# EasyEDA Pro project ProProject_基于STM32的Buck-Boost型数字电源_2024-06-04.epro, schematic 电源板

## Sheets
1 主电路: Create Date: 2024-02-29; Page Name: 主电路; Project Name: 基于STM32的Buck-Boost型数字电源; Schematic Name: 电源板; Update Date: 2024-06-01; Company: blog.zeruns.tech; Page Size: A4; Version: V2.0
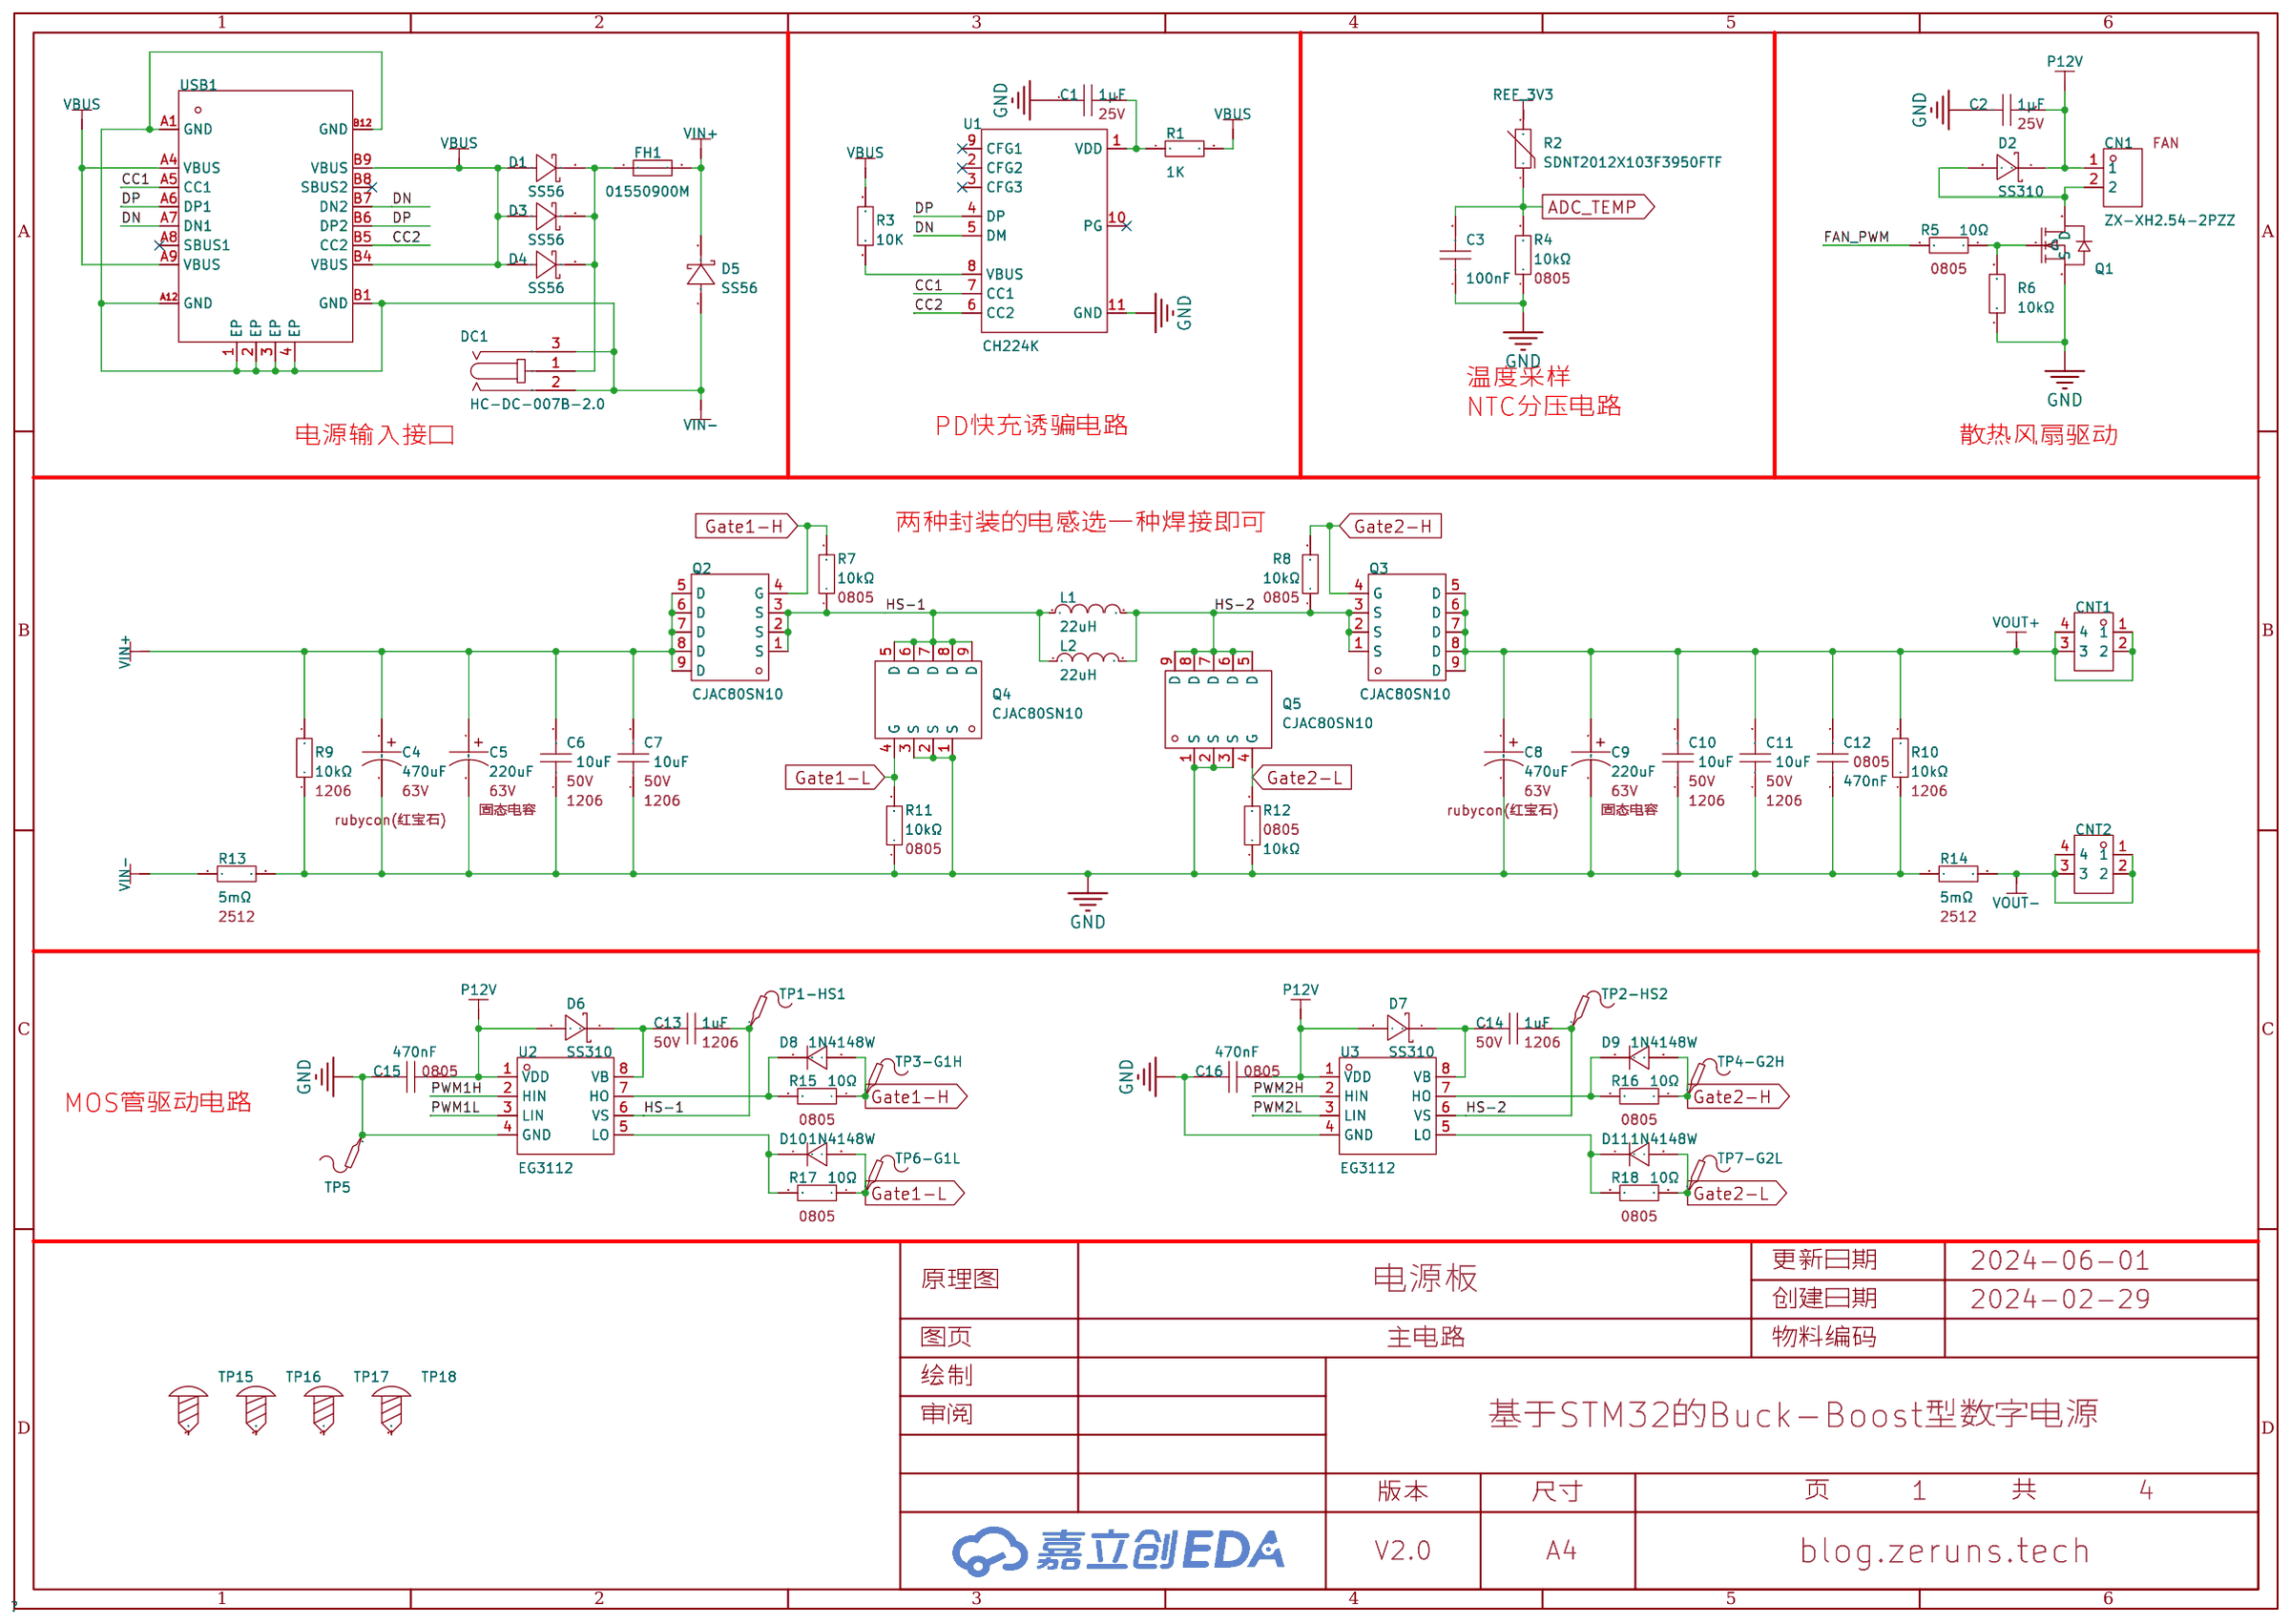
[diagram p5: 主电路]
2 辅助电源: Create Date: 2024-03-07; Page Name: 辅助电源; Update Date: 2024-04-09
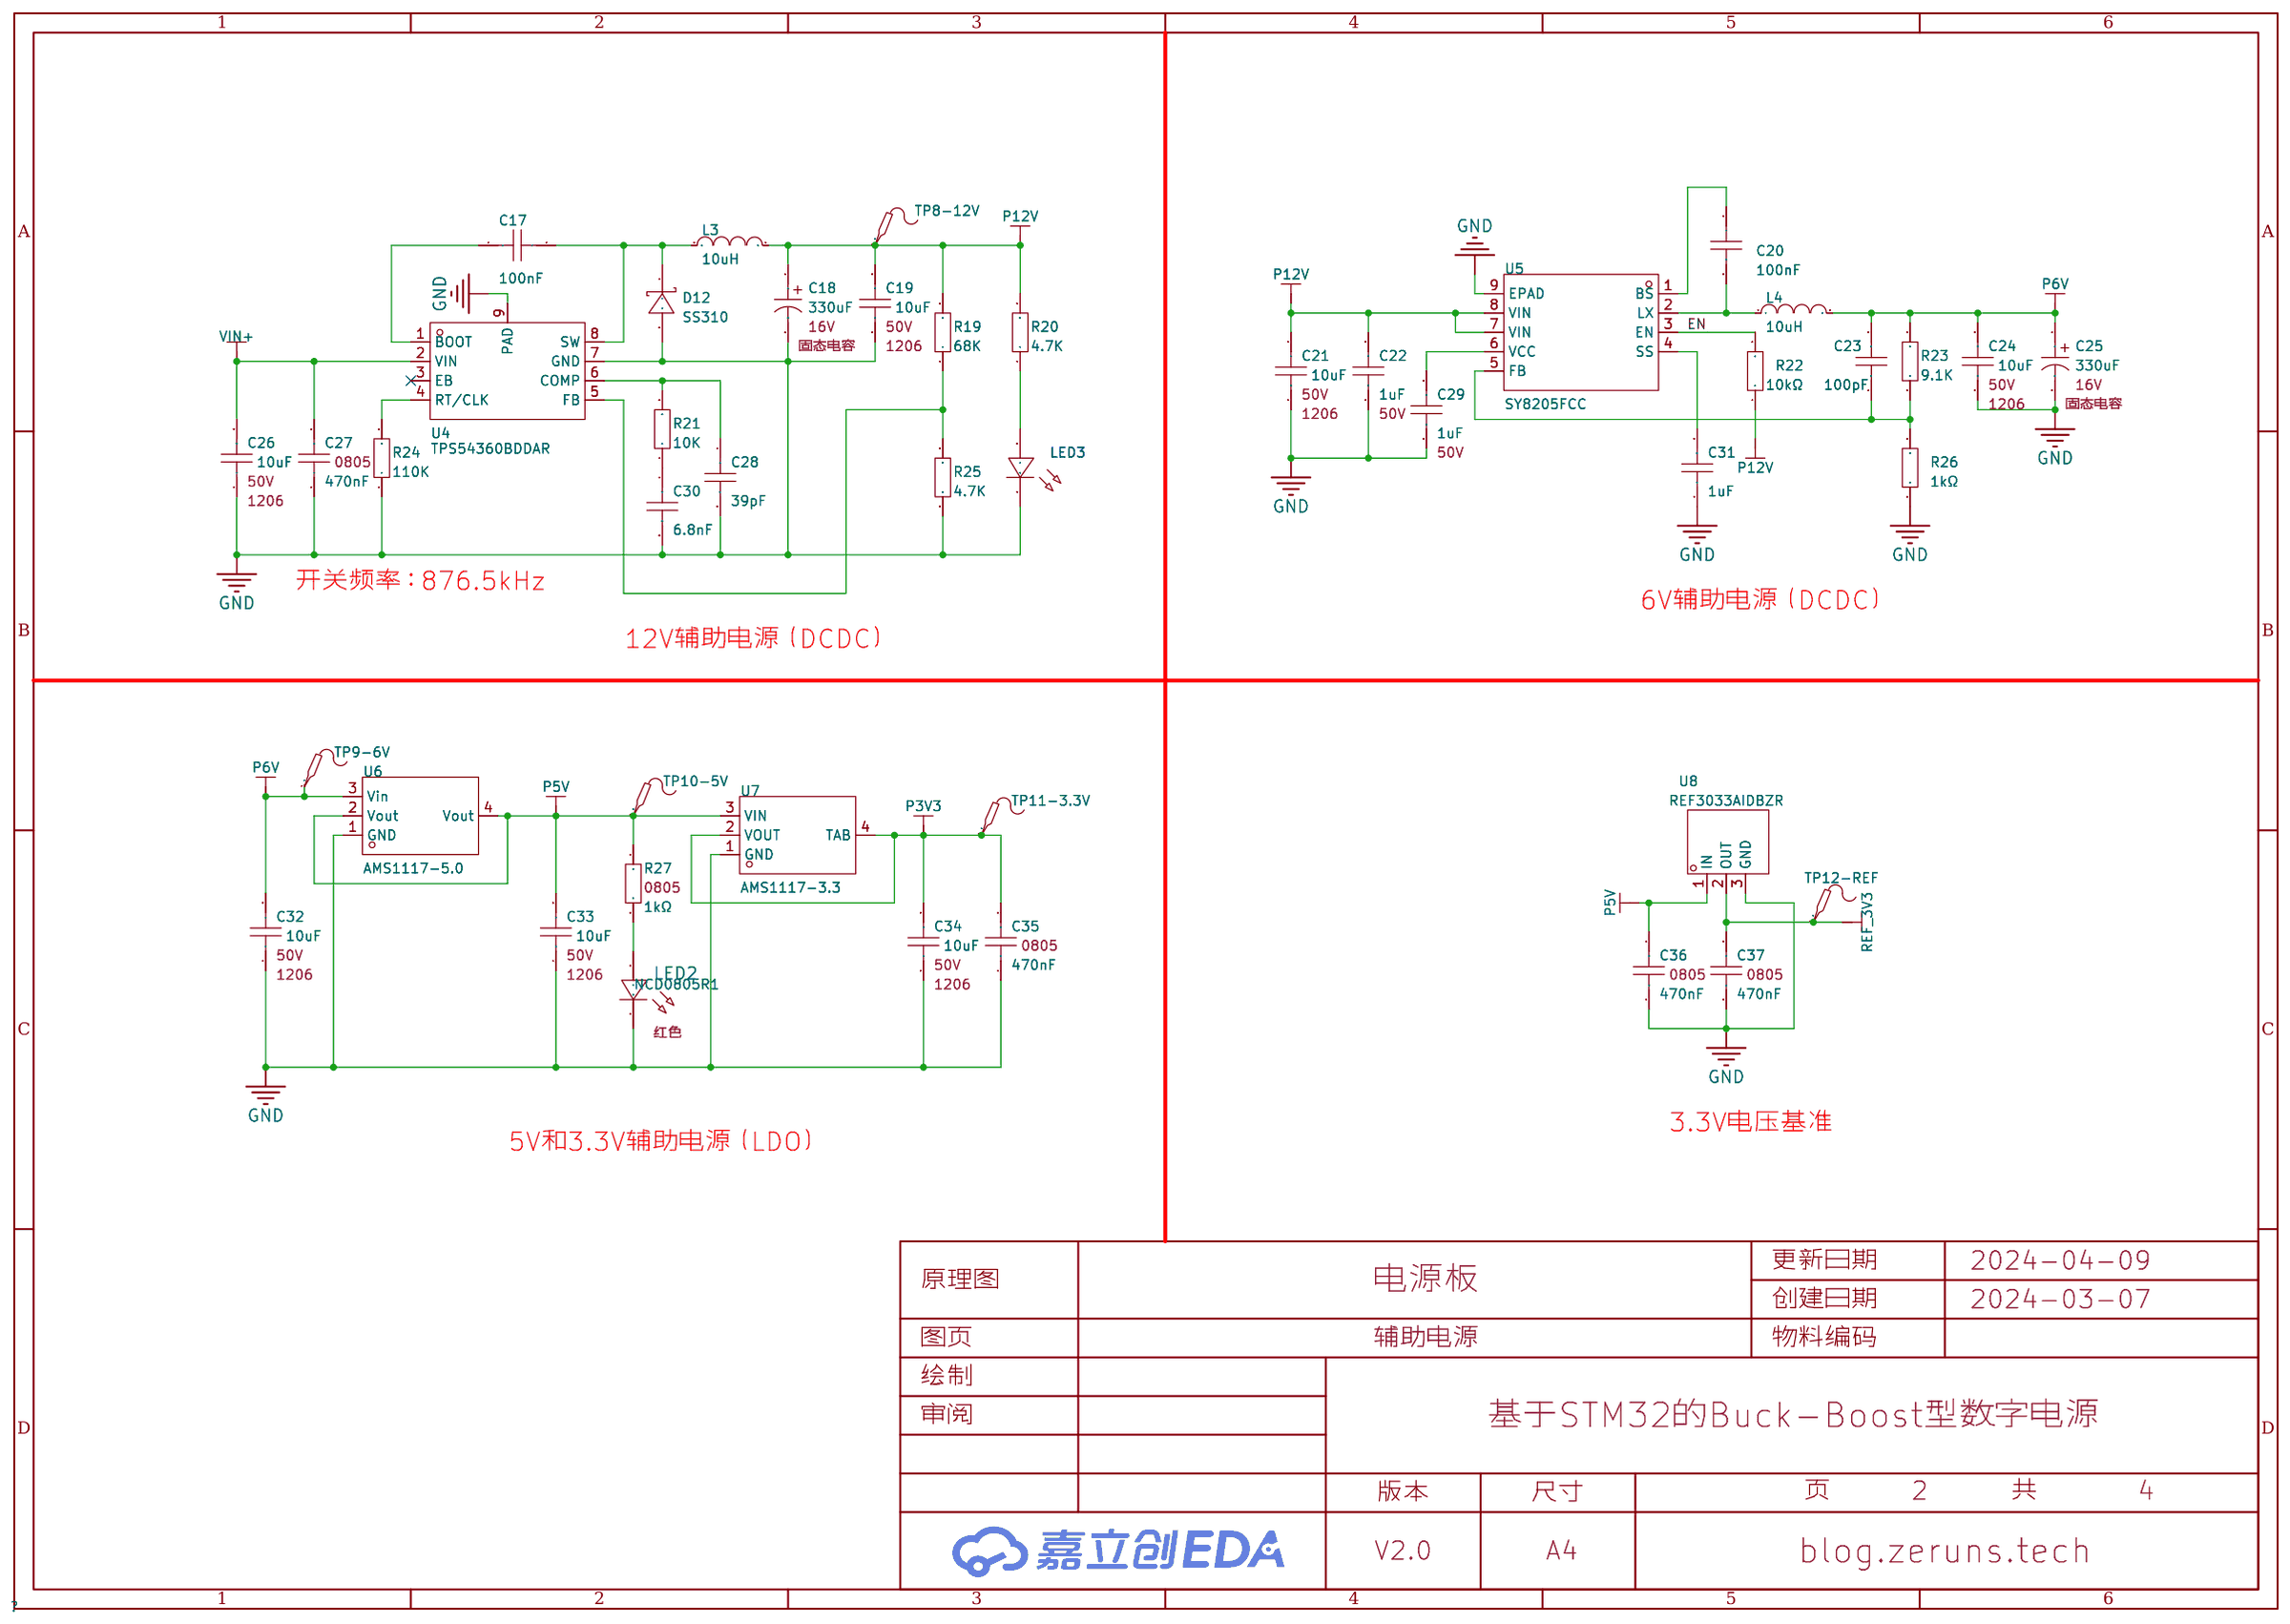
[diagram p6: 辅助电源]
3 信号调理: Create Date: 2024-03-07; Page Name: 信号调理; Update Date: 2024-03-22
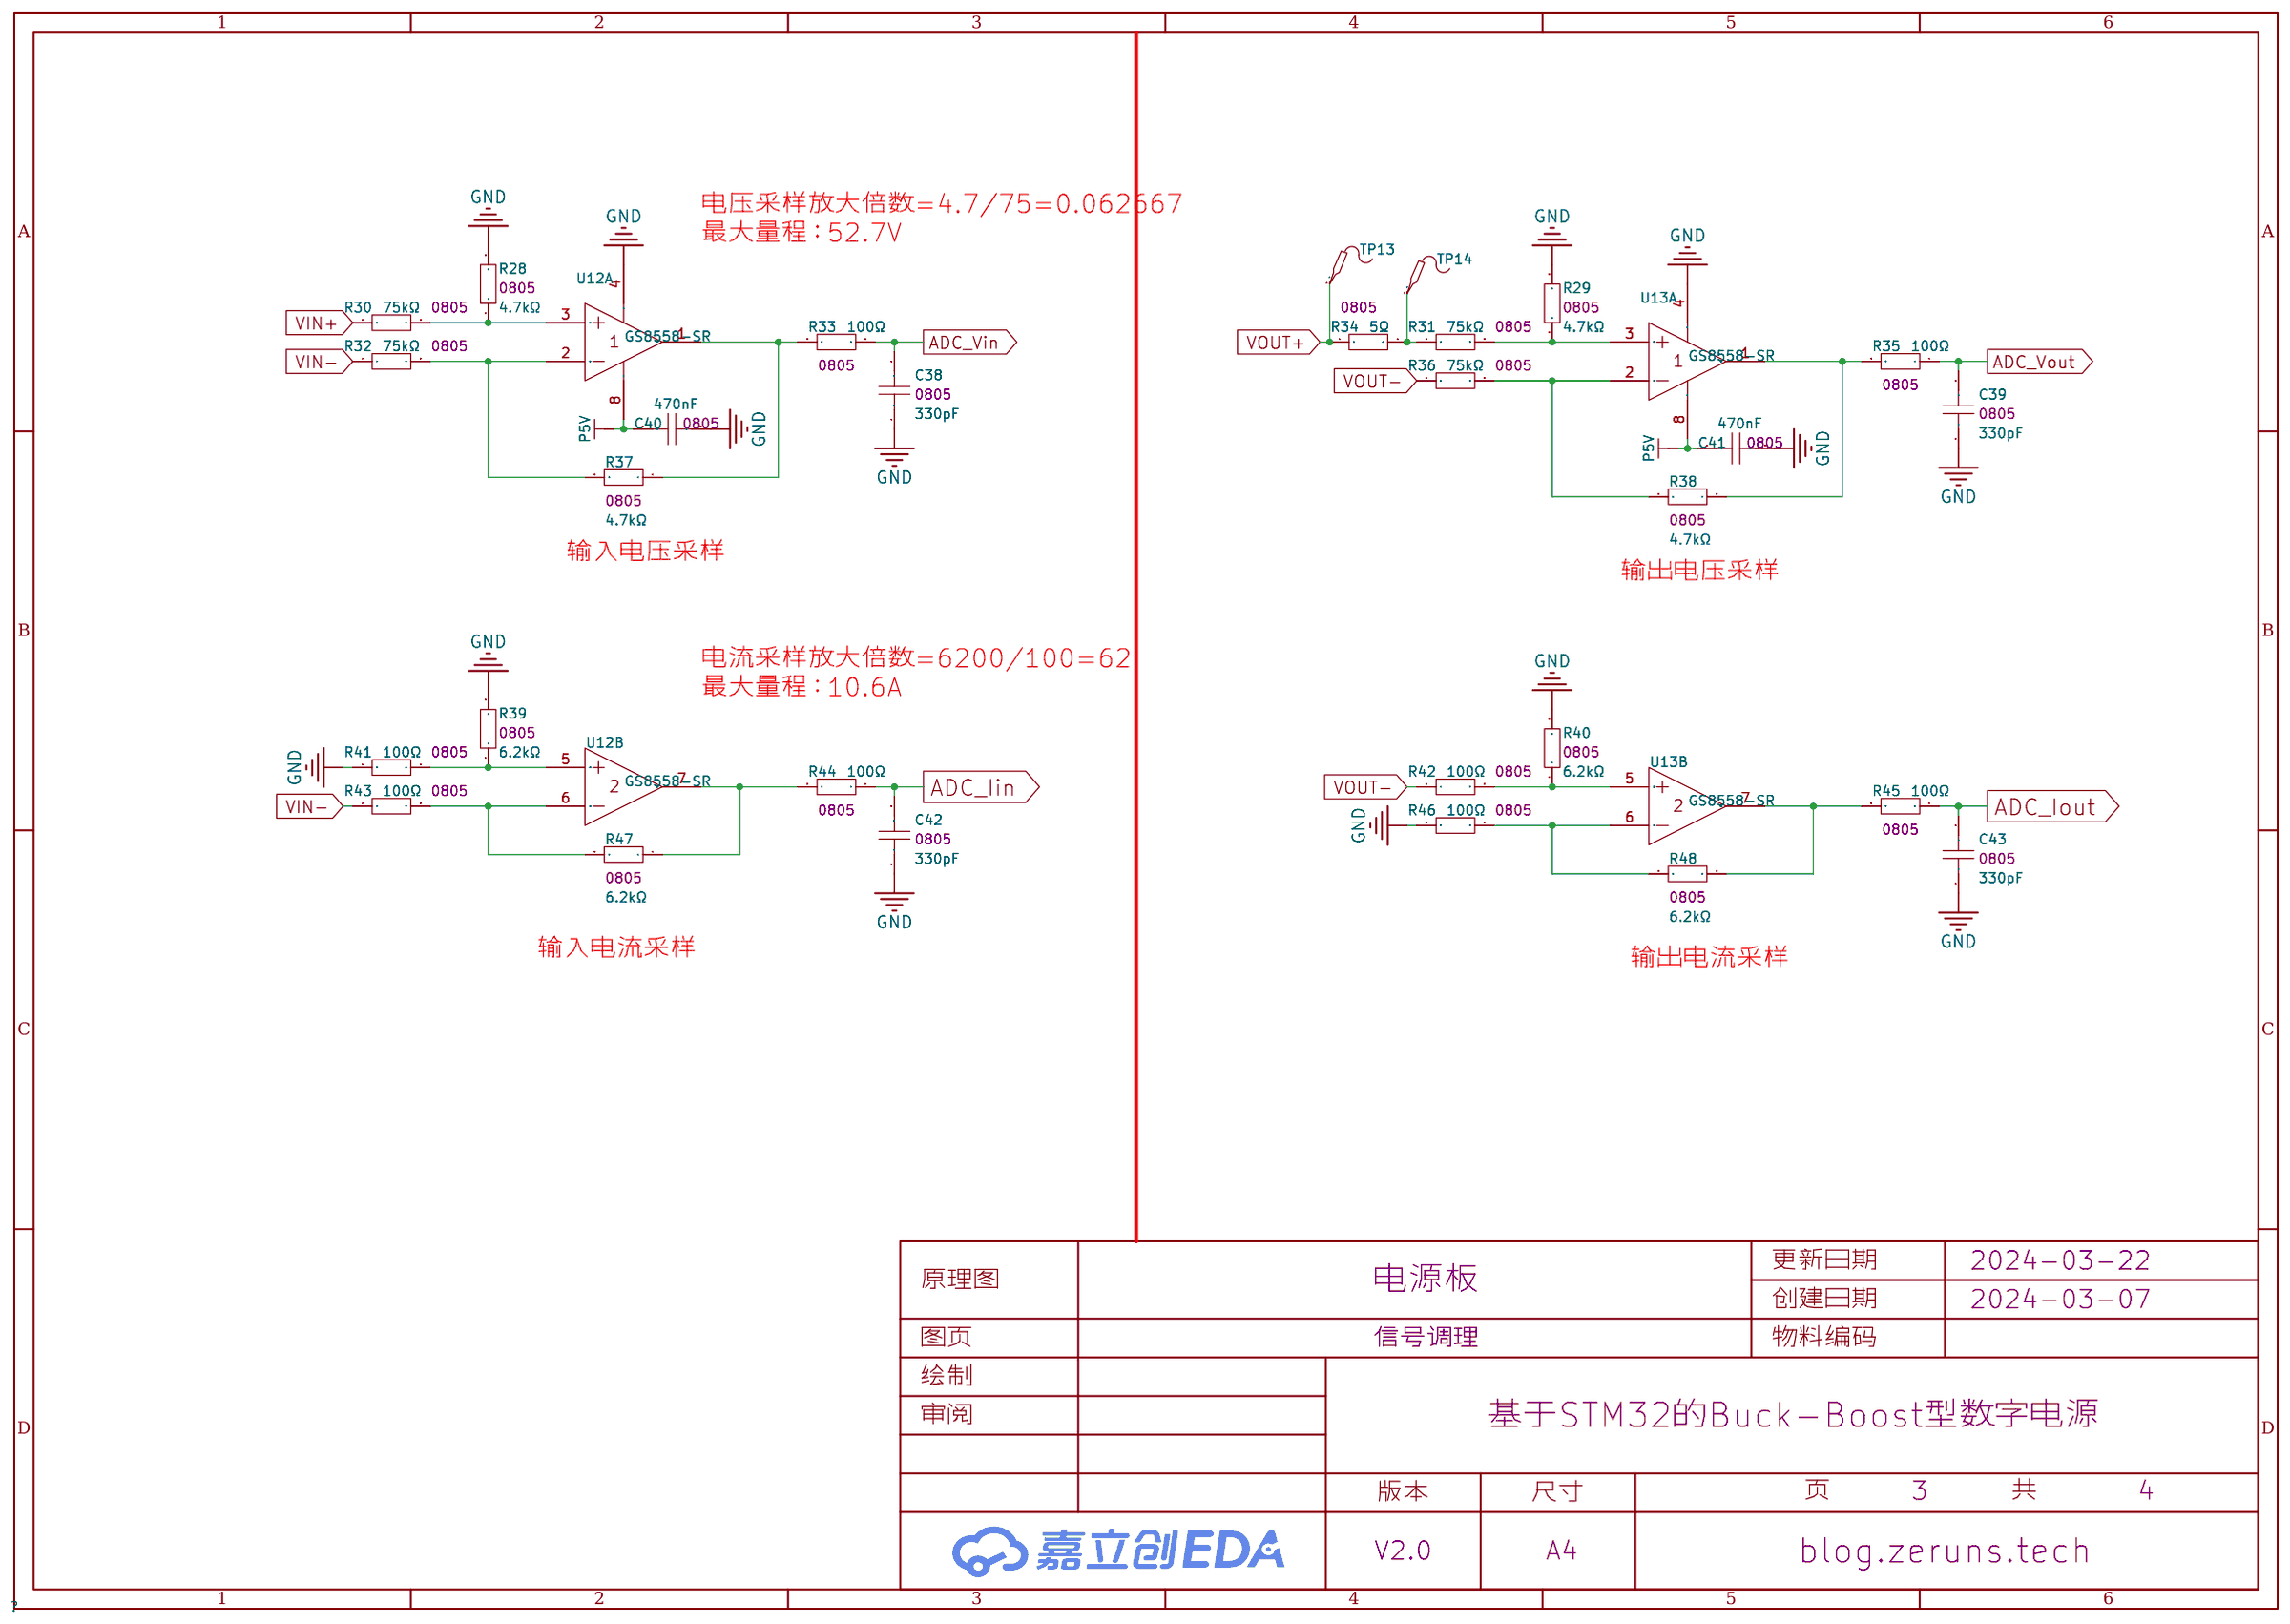
[diagram p7: 信号调理]
4 控制电路: Create Date: 2024-03-07; Page Name: 控制电路; Update Date: 2024-04-12
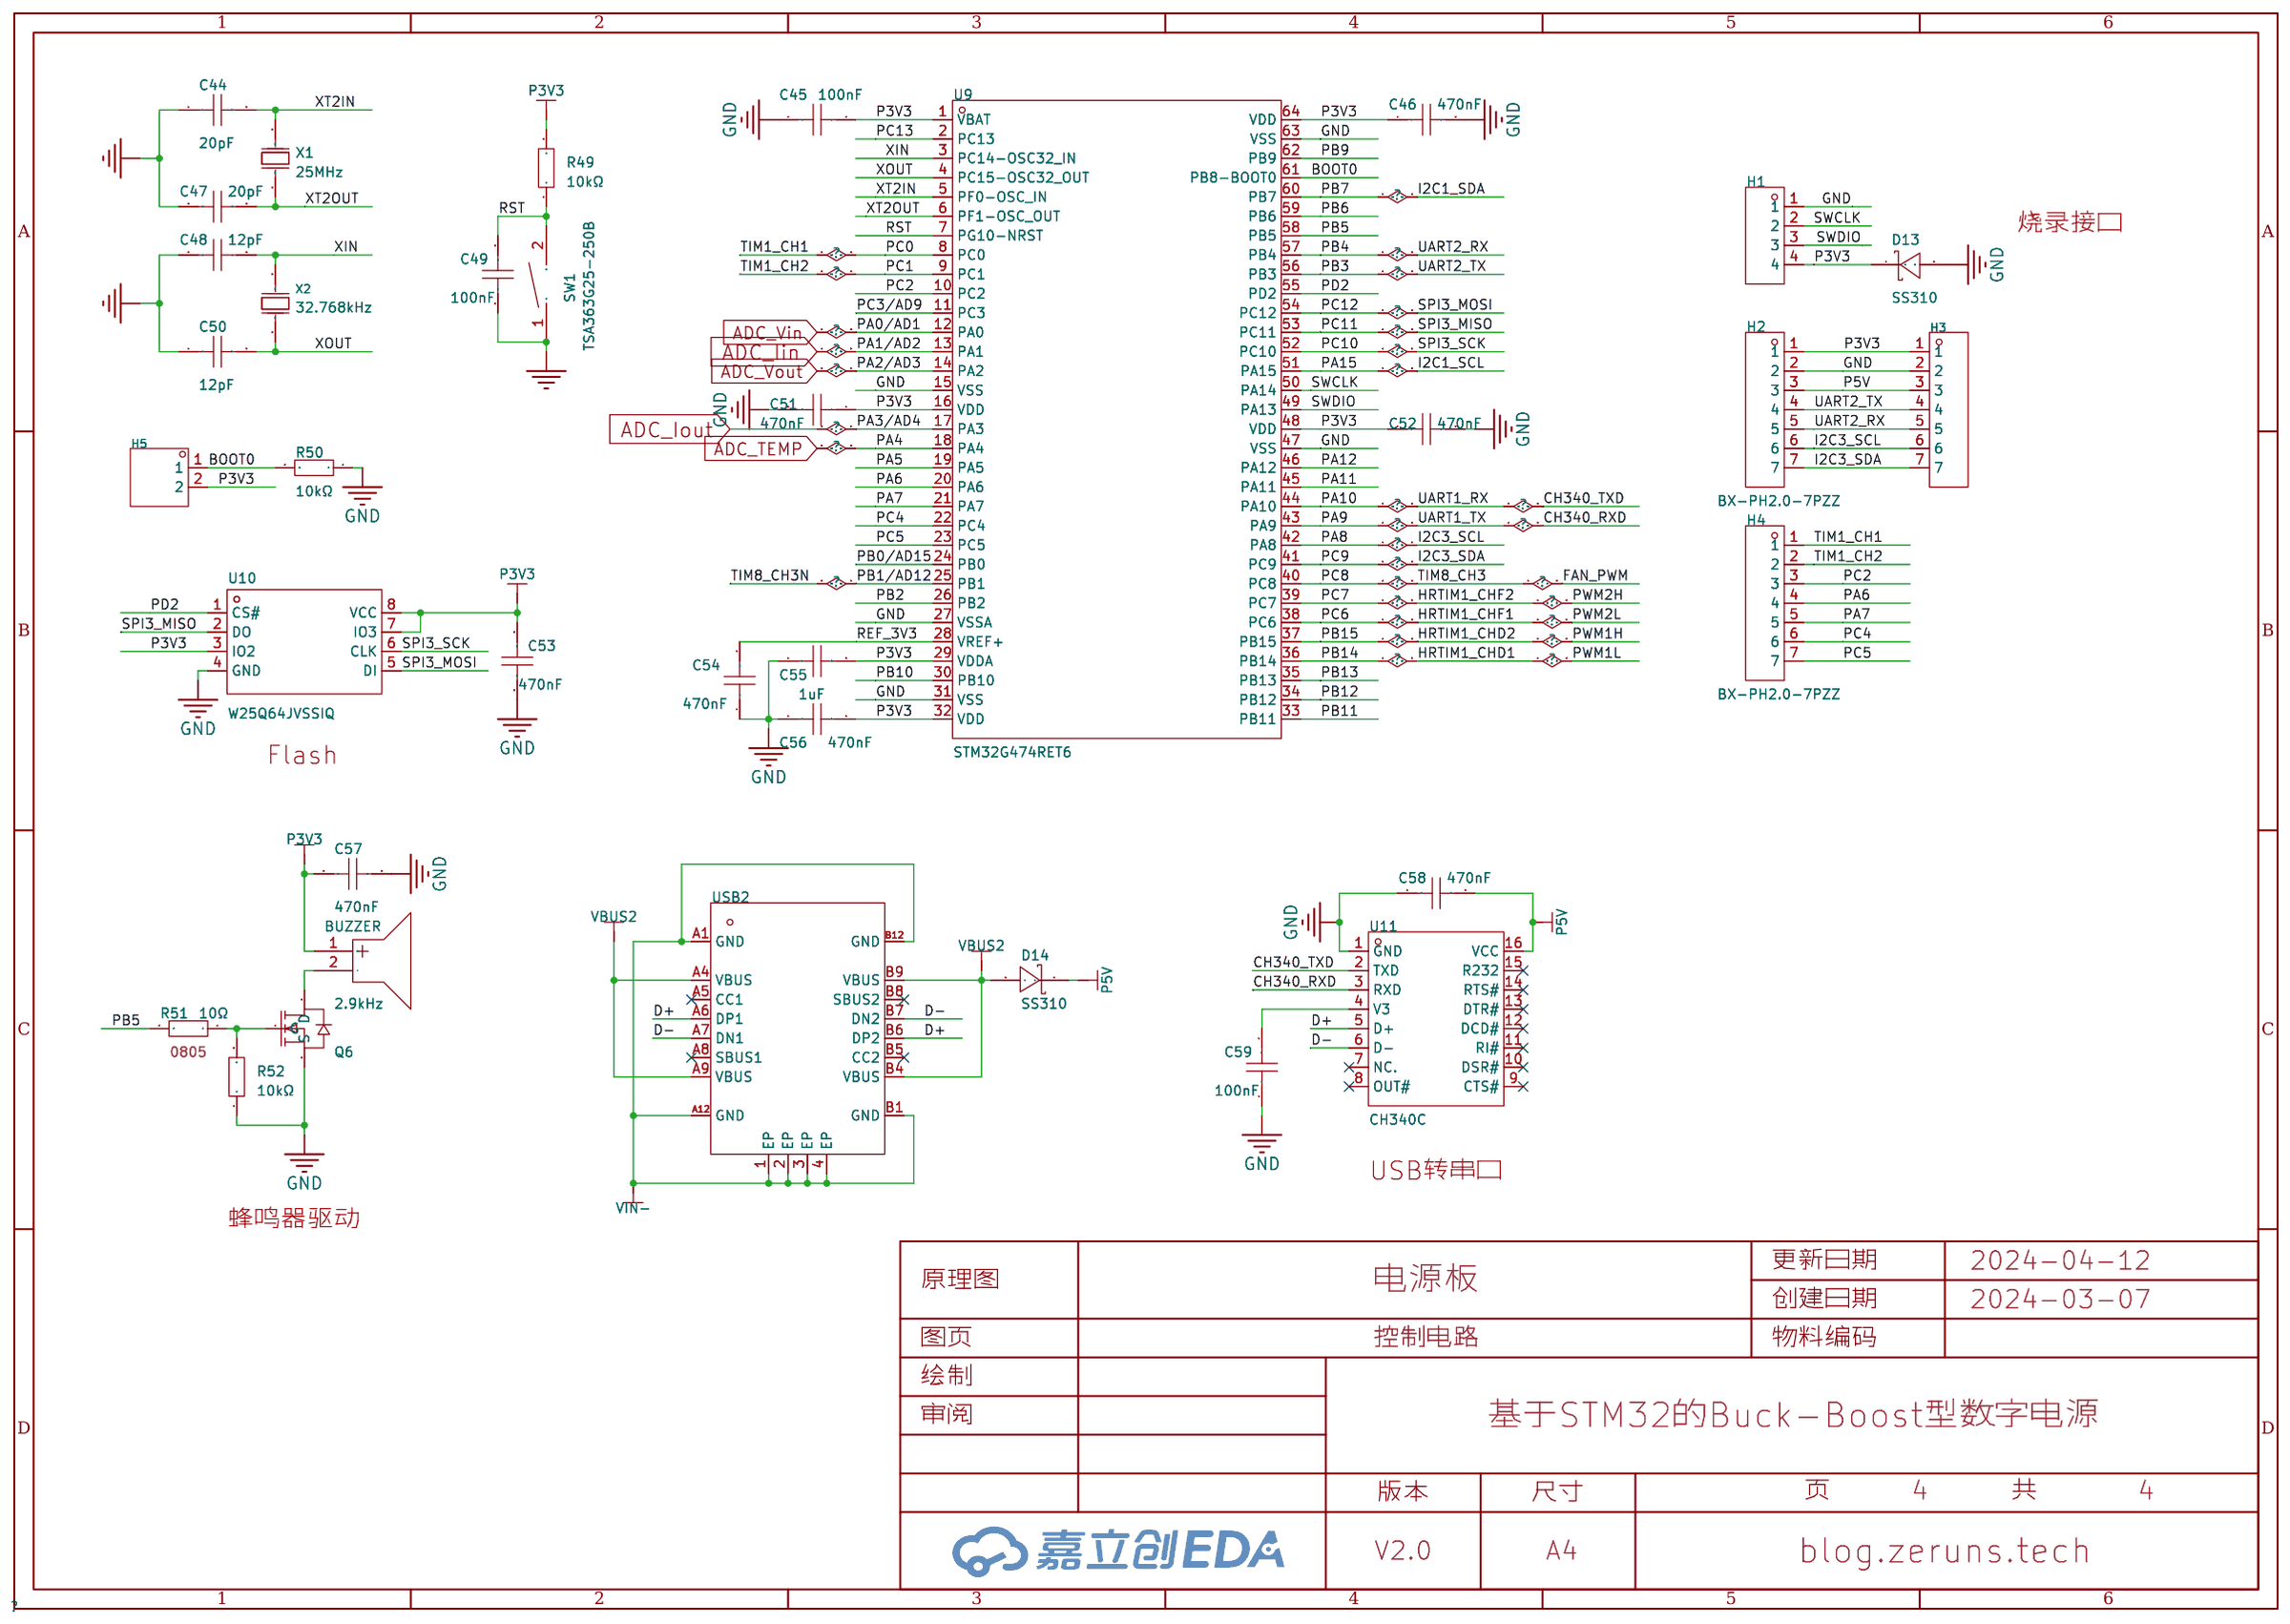
[diagram p8: 控制电路]

## Parts
sheet 主电路
C1  1μF  [C0805]
C2  1μF  [C0805]
C3  100nF  [C0805]
C4  470uF  [CAP-TH_BD12.5-P5.00-D0.6-FD]
C5  220uF  [CAP-TH_BD10.0-P5.00-D0.6-FD-A]
C6  10uF  [C1206]
C7  10uF  [C1206]
C8  470uF  [CAP-TH_BD12.5-P5.00-D0.6-FD]
C9  220uF  [CAP-TH_BD10.0-P5.00-D0.6-FD-A]
C10  10uF  [C1206]
C11  10uF  [C1206]
C12  470nF  [C0805]
C13  1uF  [C1206]
C14  1uF  [C1206]
C15  470nF  [C0805]
C16  470nF  [C0805]
CN1  ZX-XH2.54-2PZZ  [CONN-TH_2P-P2.50_HX25003-2A]
CNT1  T34001  [CONN-TH_T34001]
CNT2  T34001  [CONN-TH_T34001]
D1  SS56  [SMA_L4.3-W2.6-LS5.0-FD]
D2  SS310  [SMA_L4.3-W2.6-LS5.2-RD]
D3  SS56  [SMA_L4.3-W2.6-LS5.0-FD]
D4  SS56  [SMA_L4.3-W2.6-LS5.0-FD]
D5  SS56  [SMA_L4.3-W2.6-LS5.0-FD]
D6  SS310  [SMA_L4.3-W2.6-LS5.2-RD]
D7  SS310  [SMA_L4.3-W2.6-LS5.2-RD]
D8  1N4148W  [SOD-123_L2.8-W1.8-LS3.7-RD]
D9  1N4148W  [SOD-123_L2.8-W1.8-LS3.7-RD]
D10  1N4148W  [SOD-123_L2.8-W1.8-LS3.7-RD]
D11  1N4148W  [SOD-123_L2.8-W1.8-LS3.7-RD]
DC1  HC-DC-007B-2.0  [DC-IN-TH_HC-DC-007B-2.0]
FH1  01550900M  [FUSE-SMD_L9.8-W5.0]
L1  22uH  [IND-SMD_L17.0-W17.0_YSPIA1770-100M]
L2  22uH  [IND-TH_L29.0-W12.0-P10.00]
Q1  -  [SOT-23-3_L2.9-W1.3-P1.90-LS2.4-BR]
Q2  CJAC80SN10  [PDFN-8_L5.8-W5.0-P1.27-LS6.0-BL]
Q3  CJAC80SN10  [PDFN-8_L5.8-W5.0-P1.27-LS6.0-BL]
Q4  CJAC80SN10  [PDFN-8_L5.8-W5.0-P1.27-LS6.0-BL]
Q5  CJAC80SN10  [PDFN-8_L5.8-W5.0-P1.27-LS6.0-BL]
R1  1K  [R1206]
R2  SDNT2012X103F3950FTF  [R0805]
R3  10K  [R0805]
R4  10kΩ  [R0805]
R5  10Ω  [R0805]
R6  10kΩ  [R0805]
R7  10kΩ  [R0805]
R8  10kΩ  [R0805]
R9  10kΩ  [R1206]
R10  10kΩ  [R1206]
R11  10kΩ  [R0805]
R12  10kΩ  [R0805]
R13  5mΩ  [R2512]
R14  5mΩ  [R2512]
R15  10Ω  [R0805]
R16  10Ω  [R0805]
R17  10Ω  [R0805]
R18  10Ω  [R0805]
TP1-HS1  -  [Test-Point-0.5mm]
TP2-HS2  -  [Test-Point-0.5mm]
TP3-G1H  -  [Test-Point-0.5mm]
TP4-G2H  -  [Test-Point-0.5mm]
TP5  -  [Test-Point-0.5mm]
TP6-G1L  -  [Test-Point-0.5mm]
TP7-G2L  -  [Test-Point-0.5mm]
TP15  -  [M3螺丝]
TP16  -  [M3螺丝]
TP17  -  [M3螺丝]
TP18  -  [M3螺丝]
U1  CH224K  [ESSOP-10_L4.9-W3.9-P1.0-LS6.0-TL-EP]
U2  EG3112  [SOP-8_L5.0-W3.9-P1.27-LS6.0-BL]
U3  EG3112  [SOP-8_L5.0-W3.9-P1.27-LS6.0-BL]
USB1  -  [USB_TYPE-C-16P]
sheet 信号调理
C38  330pF  [C0805]
C39  330pF  [C0805]
C40  470nF  [C0805]
C41  470nF  [C0805]
C42  330pF  [C0805]
C43  330pF  [C0805]
R28  4.7kΩ  [R0805]
R29  4.7kΩ  [R0805]
R30  75kΩ  [R0805]
R31  75kΩ  [R0805]
R32  75kΩ  [R0805]
R33  100Ω  [R0805]
R34  5Ω  [R0805]
R35  100Ω  [R0805]
R36  75kΩ  [R0805]
R37  4.7kΩ  [R0805]
R38  4.7kΩ  [R0805]
R39  6.2kΩ  [R0805]
R40  6.2kΩ  [R0805]
R41  100Ω  [R0805]
R42  100Ω  [R0805]
R43  100Ω  [R0805]
R44  100Ω  [R0805]
R45  100Ω  [R0805]
R46  100Ω  [R0805]
R47  6.2kΩ  [R0805]
R48  6.2kΩ  [R0805]
TP13  -  [Test-Point-0.5mm]
TP14  -  [Test-Point-0.5mm]
U12  GS8558-SR  [SOIC-8_L4.9-W3.8-P1.27-LS6.0-BL]  (sections 1,2)
U13  GS8558-SR  [SOIC-8_L4.9-W3.8-P1.27-LS6.0-BL]  (sections 1,2)
sheet 控制电路
BUZZER  2.9kHz  [BUZ-TH_BD9.0-P5.00-D0.6-FD]
C44  20pF  [C0805]
C45  100nF  [C0805]
C46  470nF  [C0805]
C47  20pF  [C0805]
C48  12pF  [C0805]
C49  100nF  [C0805]
C50  12pF  [C0805]
C51  470nF  [C0805]
C52  470nF  [C0805]
C53  470nF  [C0805]
C54  470nF  [C0805]
C55  1uF  [C0805]
C56  470nF  [C0805]
C57  470nF  [C0805]
C58  470nF  [C0805]
C59  100nF  [C0805]
D13  SS310  [SMA_L4.3-W2.6-LS5.2-RD]
D14  SS310  [SMA_L4.3-W2.6-LS5.2-RD]
H1  -  [HDR-TH_4P-P2.54-V-M]
H2  BX-PH2.0-7PZZ  [CONN-TH_7P-P2.00_BX-PH2.0-7PZZ]
H3  -  [HDR-TH_7P-P2.54-V-M]
H4  BX-PH2.0-7PZZ  [CONN-TH_7P-P2.00_BX-PH2.0-7PZZ]
H5  -  [HDR-TH_2P-P2.54-V-M-1]
Q6  -  [SOT-23-3_L2.9-W1.3-P1.90-LS2.4-BR]
R49  10kΩ  [R0805]
R50  10kΩ  [R0805]
R51  10Ω  [R0805]
R52  10kΩ  [R0805]
SW1  TSA363G25-250B  [SW-SMD_L6.1-W3.6-LS8.0]
U9  STM32G474RET6  [LQFP-64_L10.0-W10.0-P0.50-LS12.0-BL]
U10  W25Q64JVSSIQ  [SOP-8_L5.3-W5.3-P1.27-LS8.0-BL]
U11  CH340C  [SOP-16_L10.0-W3.9-P1.27-LS6.0-BL]
USB2  -  [USB_TYPE-C-16P]
X1  25MHz  [OSC-SMD_L5.0-W3.2]
X2  32.768kHz  [CRYSTAL-SMD_L3.2-W1.5-2]
sheet 辅助电源
C17  100nF  [C0805]
C18  330uF  [CAP-TH_BD6.3-P2.50-D1.0-FD]
C19  10uF  [C1206]
C20  100nF  [C0805]
C21  10uF  [C1206]
C22  1uF  [C0805]
C23  100pF  [C0805]
C24  10uF  [C1206]
C25  330uF  [CAP-TH_BD6.3-P2.50-D1.0-FD]
C26  10uF  [C1206]
C27  470nF  [C0805]
C28  39pF  [C0805]
C29  1uF  [C0805]
C30  6.8nF  [C0805]
C31  1uF  [C0805]
C32  10uF  [C1206]
C33  10uF  [C1206]
C34  10uF  [C1206]
C35  470nF  [C0805]
C36  470nF  [C0805]
C37  470nF  [C0805]
D12  SS310  [SMA_L4.3-W2.6-LS5.2-RD]
L3  10uH  [IND-SMD_L4.0-W4.0]
L4  10uH  [IND-SMD_L4.0-W4.0]
LED2  NCD0805R1  [LED_0805]
LED3  -  [LED_0805]
R19  68K  [R0805]
R20  4.7K  [R0805]
R21  10K  [R0805]
R22  10kΩ  [R0805]
R23  9.1K  [R0805]
R24  110K  [R0805]
R25  4.7K  [R0805]
R26  1kΩ  [R0805]
R27  1kΩ  [R0805]
TP8-12V  -  [Test-Point-0.5mm]
TP9-6V  -  [Test-Point-0.5mm]
TP10-5V  -  [Test-Point-0.5mm]
TP11-3.3V  -  [Test-Point-0.5mm]
TP12-REF  -  [Test-Point-0.5mm]
U4  TPS54360BDDAR  [SOIC-8_L5.0-W4.0-P1.27-LS6.0-BL-EP2.0]
U5  SY8205FCC  [SOIC-8_L5.0-W4.0-P1.27-LS6.0-BL-EP2.0]
U6  AMS1117-5.0  [SOT-223-4_L6.5-W3.5-P2.30-LS7.0-BR]
U7  AMS1117-3.3  [SOT-223-3_L6.5-W3.5-P3.05-LS7.0]
U8  REF3033AIDBZR  [SOT-23-3_L3.0-W1.7-P0.95-LS2.9-BR]

## Library data of the parts
C1 C2 = CAP_0805: Supplier Footprint: 0805; 额定电压: 25V
C3 C17 C28 C30 C45 C46 C51-C59 = CAP_0805: Supplier Footprint: 0805
C4 C8 = 63YXJ470M12.5X25: 容值:470uF;精度:±20%;额定电压:63V;纹波电流:1.493A@120Hz;等效串联电阻:-;; LCSC Part Name: 470uF ±20% 63V; Supplier Part: C780088; Manufacturer: rubycon(红宝石); Supplier Footprint: 插件,D12.5xL25mm; JLCPCB Part Class: 扩展库; Datasheet: https://atta.szlcsc.com/upload/public/pdf/source/20201030/C780088_1A339567CDAE2EB97A382F5A2D276BE1.pdf; Supplier: LCSC; Tolerance: ±20%; Rated Voltage: 63V; Ripple Current: 1.493A@120Hz; Lead Spacing: 5mm; φD: 12.5mm; L: 25mm; Lifetime @ Temp: 10000hrs@105℃; Operating Temperature: -40℃~+105℃
C5 C9 = SPZ1JM221G15O00RAXXX: 容值:220uF;精度:±20%;额定电压:63V;纹波电流:2.65A@100kHz;等效串联电阻:20mΩ@100kHz;类型:聚合物;; LCSC Part Name: 220uF ±20% 63V; Supplier Part: C2983797; Manufacturer: AISHI(艾华集团); Supplier Footprint: 插件,D10xL15mm; JLCPCB Part Class: 扩展库; Datasheet: https://atta.szlcsc.com/upload/public/pdf/source/20180906/C160181_A9A2ACDA3CC278FCDBAF747E681A6DA5.pdf; Supplier: LCSC; Tolerance: ±20%; Rated Voltage: 63V; Ripple Current: 2.65A@100kHz; Equivalent Series Resistance(ESR): 20mΩ@100kHz; Type: 聚合物; Lead Spacing: 5mm; φD: 10mm; L: 15mm; Lifetime @ Temp: 2000hrs@105℃; Operating Temperature: -55℃~+105℃; 备注: 固态电容
C6 C7 C10 C11 C13 C14 C19 C21 C24 C26 C32-C34 = CS3216X5R106K500NRI: 容值:10uF;精度:±10%;额定电压:50V;材质(温度系数):X5R;; LCSC Part Name: 10uF ±10% 50V; Supplier Part: C513774; Manufacturer: SAMWHA(三和); Supplier Footprint: 1206; JLCPCB Part Class: Extended Part; Datasheet: https://atta.szlcsc.com/upload/public/pdf/source/20200519/C513774_8E6AF19D7056FD60653684FA0E0AD594.pdf; Supplier: LCSC; Tolerance: ±10%; Voltage Rated: 50V; Temperature Coefficient: X5R; 额定电压: 50V
C12 C15 C16 C27 C35-C37 C40 C41 = CL21B474KBFNNNE: 容值:470nF;精度:±10%;额定电压:50V;材质(温度系数):X7R;; LCSC Part Name: 470nF ±10% 50V; Supplier Part: C13967; Manufacturer: SAMSUNG(三星); Supplier Footprint: 0805; JLCPCB Part Class: Basic Part; Datasheet: https://atta.szlcsc.com/upload/public/pdf/source/20160218/1457707763339.pdf; Supplier: LCSC; Tolerance: ±10%; Voltage Rated: 50V; Temperature Coefficient: X7R
CN1 = ZX-XH2.54-2PZZ: 插针结构:1x2P;间距:2.54mm;安装方式:直插;参考系列:XH;总PIN数:2P;排数:1;每排PIN数:2;行距:-;额定电流:3A;触头材质:黄铜;触头镀层:锡;工作温度范围:-25℃~+85℃;; Supplier Part: C7429632; Manufacturer: Megastar(兆星); Supplier Footprint: 插件,P=2.54mm; JLCPCB Part Class: 扩展库; Datasheet: https://atta.szlcsc.com/upload/public/pdf/source/20230619/19BA6947230AA44A04D3EDD65E618FD0.pdf; Supplier: LCSC; Pins Structure: 1x2P; Pitch: 2.54mm; Mounting Style: 直插; Reference Series: XH; Number of Pins: 2P; Number of Rows: 1; Number of PINs Per Row: 2; Current Rating (Max): 3A; Contact Material: 黄铜; Contact Plating: 锡; Operating Temperature Range: -25℃~+85℃; 备注: FAN
CNT1 CNT2 = T34001: LCSC Part Name: 四脚 M3 二件套; Supplier Part: C481448; Manufacturer: XFCN(兴飞); Supplier Footprint: 插件; JLCPCB Part Class: 扩展库; Datasheet: https://atta.szlcsc.com/upload/public/pdf/source/20200107/C481448_4214B4EB74A46B70BD82BA8A456D4EDD.pdf; Supplier: LCSC
D1 D3-D5 = SS56_C727066: 二极管配置:独立式;正向压降(Vf):700mV@5A;直流反向耐压(Vr):60V;平均整流电流(Io):5A;; LCSC Part Name: 电压:60V 电流:5A; Supplier Part: C727066; Manufacturer: TWGMC(台湾迪嘉); Supplier Footprint: SMA(DO-214AC); JLCPCB Part Class: 扩展库; Datasheet: https://atta.szlcsc.com/upload/public/pdf/source/20200828/C727064_BD0A2B36CBC76CEA4B6710C57718D41F.pdf; Supplier: LCSC; Diode Configuration: 独立式; Forward Voltage (Vf@If): 700mV@5A; Reverse Voltage (Vr): 60V; Average Rectified Current (Io): 5A; Reverse Leakage Current (Ir): 500uA@60V
D2 D6 D7 D12-D14 = SS310_C15874: 直流反向耐压(Vr):100V;平均整流电流(Io):3A;正向压降(Vf):850mV@3A;; LCSC Part Name: 100V 3A 850mV@3A; Supplier Part: C15874; Manufacturer: MDD; Supplier Footprint: SMA(DO-214AC); JLCPCB Part Class: 扩展库; Datasheet: https://atta.szlcsc.com/upload/public/pdf/source/20230314/A80AE34493C69B89E2F4B1712F433538.pdf; Supplier: LCSC; Reverse Voltage (Vr): 100V; Average Rectified Current (Io): 3A; Forward Voltage (Vf@If): 850mV@3A
D8-D11 = 1N4148W_C2099: 二极管配置:独立式;正向压降(Vf):1.25V@150mA;直流反向耐压(Vr):100V;平均整流电流(Io):150mA;功率:500mW;反向恢复时间(trr):4ns;; LCSC Part Name: 电压:100V 电流:150mA; Supplier Part: C2099; Manufacturer: CJ(江苏长电/长晶); Supplier Footprint: SOD-123; JLCPCB Part Class: Extended Part; Datasheet: https://atta.szlcsc.com/upload/public/pdf/source/20120428/1457706480199.pdf; Supplier: LCSC; Diode Configuration: 独立式; Forward Voltage (Vf@If): 1.25V@150mA; Reverse Voltage (Vr): 100V; Average Rectified Current (Io): 150mA; Power Dissipation: 500mW; Reverse Leakage Current: 1uA@75V; Reverse Recovery Time (trr): 4ns
DC1 = HC-DC-007B-2.0: 连接器类型:DC电源插座;安装方式:弯插;触点内径:2mm;触点外径:6.45mm;额定电流:8A;额定电压:24V;触头材质:黄铜;触头镀层:锡;工作温度范围:-30℃~+70℃;; LCSC Part Name: DC电源插座 内径:2mm 外径:6.45mm; Supplier Part: C3010537; Manufacturer: HCTL(华灿天禄); Supplier Footprint: 插件; JLCPCB Part Class: 扩展库; Datasheet: https://atta.szlcsc.com/upload/public/pdf/source/20230915/67ED5E7C0D0B95B6C7108D18FA563FB0.pdf; Supplier: LCSC; Connector Type: DC电源插座; Mounting Style: 弯插; Inside Contact Diameter: 2mm; Outside Contact Diameter: 6.45mm; Current Rating (Max): 8A; Voltage Rating (Max): 24V; Contact Material: 黄铜; Contact Plating: 锡; Operating Temperature Range: -30℃~+70℃
FH1 = 01550900M: 保险丝座类型:-;保险丝类型:-;; Supplier Part: C108518; Manufacturer: Littelfuse(美国力特); Supplier Footprint: SMD,5.0x9.7mm; JLCPCB Part Class: 扩展库; Datasheet: https://atta.szlcsc.com/upload/public/pdf/source/20181031/C315847_D8C8759CD5ED576C0EA975A2D5312378.pdf; Supplier: LCSC
L1 = CY1770AT125DS-220MC: 电感值:22uH;精度:±20%;; LCSC Part Name: 22uH ±20%; Supplier Part: C3029016; Manufacturer: Sumida(胜美达); Supplier Footprint: SMD,17x17.5mm; JLCPCB Part Class: 扩展库; Datasheet: https://atta.szlcsc.com/upload/public/pdf/source/20221031/4071D165700437CEFF1C843D09A46A8A.pdf; Supplier: LCSC; Tolerance: ±20%
L2 = SLT092125T220MTB: 电感值:22uH;精度:±20%;额定电流:-;饱和电流(Isat):-;类型:磁环电感;Q值:-;; LCSC Part Name: 磁环电感 22uH ±20%; Supplier Part: C908344; Manufacturer: Sunltech(韩国顺磁); Supplier Footprint: 插件; JLCPCB Part Class: 扩展库; Datasheet: https://atta.szlcsc.com/upload/public/pdf/source/20201022/C908344_03602A2FED0D50CD4A737DC769BB14A8.pdf; Supplier: LCSC; Tolerance: ±20%; DC Resistance: 20mΩ; Type: 磁环电感
Q1 Q6 = AO3400A_N: 类型:N沟道;漏源电压(Vdss):30V;连续漏极电流(Id):5.2A;功率(Pd):1W;导通电阻(RDS(on)@Vgs,Id):35mΩ@10V,5A;阈值电压(Vgs(th)@Id):1.5V@250μA;; Supplier Footprint: SOT-23; Supplier Part: C700953
Q2-Q5 = CJAC80SN10: 类型:N沟道;漏源电压(Vdss):100V;连续漏极电流(Id):80A;功率(Pd):100W;导通电阻(RDS(on)@Vgs,Id):6.2mΩ@10V;阈值电压(Vgs(th)@Id):2.5V;; LCSC Part Name: N沟道 耐压:100V 电流:80A; Supplier Part: C2913221; Manufacturer: CJ(江苏长电/长晶); Supplier Footprint: PDFN-8(5x6); JLCPCB Part Class: 扩展库; Datasheet: https://atta.szlcsc.com/upload/public/pdf/source/20211101/4F9ADD6ECF58ED50A240A9902BC9A3EC.pdf; Supplier: LCSC; Type: N沟道; Drain Source Voltage (Vdss): 100V; Continuous Drain Current (Id): 80A; Power Dissipation (Pd): 100W; Drain Source On Resistance (RDS(on)@Vgs,Id): 6.2mΩ@10V; Gate Threshold Voltage (Vgs(th)@Id): 2.5V; Total Gate Charge (Qg@Vgs): 46nC; Input Capacitance (Ciss@Vds): 2.2nF; Reverse Transfer Capacitance (Crss@Vds): 6.3pF; Operating Temperature: -55℃~+150℃@(Tj)
R1 = Res_1206: Supplier Footprint: 1206
R2 = SDNT2012X103F3950FTF: 阻值(25℃):10kΩ;B值(25℃/50℃):3950K;电阻精度:±1%;功率:200mW;B值精度:±1%;最大稳态电流(25℃):440uA;; LCSC Part Name: 10kΩ 电阻精度:±1% 3950K; Supplier Part: C95968; Manufacturer: Sunlord(顺络); Supplier Footprint: 0805; JLCPCB Part Class: 扩展库; Datasheet: https://atta.szlcsc.com/upload/public/pdf/source/20210916/BF106A3565EDFEB141CB3E0EA3A661F8.pdf; Supplier: LCSC; Resistance @ 25℃: 10kΩ; B Constant (25℃/50℃): 3950K; Resistance Tolerance: ±1%; Power: 200mW; B Constant Tolerance: ±1%; Steady State Current (Max): 440uA; Operating Temperature: -55℃~+125℃
R3 R19-R21 R23-R25 = Res_0805: Supplier Footprint: 0805
R4 R7 R8 R11 R12 = 0805W8F1002T5E_C17414: 阻值:10kΩ;精度:±1%;功率:125mW;温度系数:±100ppm/℃;电阻类型:厚膜电阻;; LCSC Part Name: 10kΩ ±1% 125mW 厚膜电阻; Supplier Part: C17414; Manufacturer: UNI-ROYAL(厚声); Manufacturer Part: 0805W8F1002T5E; Supplier Footprint: 0805; JLCPCB Part Class: Basic Part; Datasheet: https://atta.szlcsc.com/upload/public/pdf/source/20200306/C422600_1E6D84923E4A46A82E41ADD87F860B5C.pdf; Supplier: LCSC; Tolerance: ±1%; Power(Watts): 125mW; Overload Voltage (Max): 150V; Temperature Coefficient: ±100ppm/℃; Type: 厚膜电阻; Operating Temperature Range: -55℃~+155℃
R5 R15-R18 R51 = 0805W8F100JT5E: 阻值:10Ω;精度:±1%;功率:125mW;温度系数:±200ppm/℃;电阻类型:厚膜电阻;; LCSC Part Name: 10Ω ±1% 125mW 厚膜电阻; Supplier Part: C17415; Manufacturer: UNI-ROYAL(厚声); Supplier Footprint: 0805; JLCPCB Part Class: Basic Part; Datasheet: https://atta.szlcsc.com/upload/public/pdf/source/20200306/C422600_1E6D84923E4A46A82E41ADD87F860B5C.pdf; Supplier: LCSC; Tolerance: ±1%; Power(Watts): 125mW; Overload Voltage (Max): 150V; Temperature Coefficient: ±200ppm/℃; Type: 厚膜电阻; Operating Temperature Range: -55℃~+155℃
R6 R22 R49 R50 R52 = 0805W8F1002T5E_C17414: 电阻类型:厚膜电阻;阻值:10kΩ;精度:±1%;功率:125mW;; LCSC Part Name: 10kΩ ±1% 125mW; Supplier Part: C17414; Manufacturer: UNI-ROYAL(厚声); Manufacturer Part: 0805W8F1002T5E; Supplier Footprint: 0805; JLCPCB Part Class: Basic Part; Datasheet: https://atta.szlcsc.com/upload/public/pdf/source/20200306/C422600_1E6D84923E4A46A82E41ADD87F860B5C.pdf; Supplier: LCSC; Tolerance: ±1%; Power(Watts): 125mW; Overload Voltage (Max): 150V; Temperature Coefficient: ±100ppm/℃; Type: 厚膜电阻; Operating Temperature Range: -55℃~+155℃
R9 R10 = 1206W4F1002T5E: 阻值:10kΩ;精度:±1%;功率:250mW;温度系数:±100ppm/℃;电阻类型:厚膜电阻;; LCSC Part Name: 10kΩ ±1% 250mW 厚膜电阻; Supplier Part: C17902; Manufacturer: UNI-ROYAL(厚声); Supplier Footprint: 1206; JLCPCB Part Class: Basic Part; Datasheet: https://atta.szlcsc.com/upload/public/pdf/source/20200306/C422600_1E6D84923E4A46A82E41ADD87F860B5C.pdf; Supplier: LCSC; Tolerance: ±1%; Power(Watts): 250mW; Overload Voltage (Max): 200V; Temperature Coefficient: ±100ppm/℃; Type: 厚膜电阻; Operating Temperature Range: -55℃~+155℃
R13 R14 = RLM25FEER005: 阻值:5mΩ;精度:±1%;功率:2W;温度系数:±50ppm/℃;; LCSC Part Name: 5mΩ ±1% 2W; Supplier Part: C185817; Manufacturer: 大毅科技; Supplier Footprint: 2512; JLCPCB Part Class: 扩展库; Datasheet: https://atta.szlcsc.com/upload/public/pdf/source/20190522/C393091_6CCFAC42A3E6890A06166410451ABD03.pdf; Supplier: LCSC; Tolerance: ±1%; Power(Watts): 2W; Temperature Coefficient: ±50ppm/℃
TP1-HS1 TP2-HS2 TP3-G1H TP4-G2H TP5 TP6-G1L TP7-G2L TP8-12V TP9-6V TP10-5V TP11-3.3V TP12-REF TP13 TP14 = Test-Point: Test Point 测试点
TP15-TP18 = M3螺丝: Supplier Footprint: 插件
U1 = CH224K: 应用功能:USB充电芯片;; LCSC Part Name: USB PD等多快充协议受电芯片CH224; Supplier Part: C970725; Manufacturer: WCH(南京沁恒); Supplier Footprint: ESSOP-10; JLCPCB Part Class: 扩展库; Datasheet: https://atta.szlcsc.com/upload/public/pdf/source/20220425/5F3B4646B9AC793D88468BCB08421765.pdf; Supplier: LCSC; Applications Function: USB充电芯片
U2 U3 = EG3112: 600V，IO+1A/-1.5A，大功率MOS管、IGBT管栅极驱动IC; Supplier Part: C111908; Manufacturer: EG(屹晶微); Supplier Footprint: SOIC-8; JLCPCB Part Class: Extended Part; Datasheet: https://atta.szlcsc.com/upload/public/pdf/source/20230725/3992D5BD05E91E0CBB5D3EE72F4B3B26.pdf; Supplier: LCSC
USB1 USB2 = USB_TYPE-C-16P: Supplier Footprint: SMD
C38 C39 C42 C43 = CL21B331KBANNNC: 容值:330pF;精度:±10%;额定电压:50V;材质(温度系数):X7R;; LCSC Part Name: 330pF ±10% 50V 停产; Supplier Part: C51207; Manufacturer: SAMSUNG(三星); Supplier Footprint: 0805; JLCPCB Part Class: Extended Part; Datasheet: https://atta.szlcsc.com/upload/public/pdf/source/20160218/1457707763339.pdf; Supplier: LCSC; Tolerance: ±10%; Voltage Rated: 50V; Temperature Coefficient: X7R
R28 R29 R37 R38 = 0805W8F3301T5E: 阻值:3.3kΩ;精度:±1%;功率:125mW;温度系数:±100ppm/℃;电阻类型:厚膜电阻;; LCSC Part Name: 3.3kΩ ±1% 125mW 厚膜电阻; Supplier Part: C26010; Manufacturer: UNI-ROYAL(厚声); Supplier Footprint: 0805; JLCPCB Part Class: Basic Part; Datasheet: https://atta.szlcsc.com/upload/public/pdf/source/20200306/C422600_1E6D84923E4A46A82E41ADD87F860B5C.pdf; Supplier: LCSC; Tolerance: ±1%; Power(Watts): 125mW; Overload Voltage (Max): 150V; Temperature Coefficient: ±100ppm/℃; Type: 厚膜电阻; Operating Temperature Range: -55℃~+155℃
R30-R32 R34 R36 = 0805W8F6802T5E: 阻值:68kΩ;精度:±1%;功率:125mW;温度系数:±100ppm/℃;电阻类型:厚膜电阻;; LCSC Part Name: 68kΩ ±1% 125mW 厚膜电阻; Supplier Part: C17801; Manufacturer: UNI-ROYAL(厚声); Supplier Footprint: 0805; JLCPCB Part Class: Basic Part; Datasheet: https://atta.szlcsc.com/upload/public/pdf/source/20200306/C422600_1E6D84923E4A46A82E41ADD87F860B5C.pdf; Supplier: LCSC; Tolerance: ±1%; Power(Watts): 125mW; Overload Voltage (Max): 150V; Temperature Coefficient: ±100ppm/℃; Type: 厚膜电阻; Operating Temperature Range: -55℃~+155℃
R33 R35 R41-R46 = 0805W8F1000T5E: 阻值:100Ω;精度:±1%;功率:125mW;温度系数:±100ppm/℃;电阻类型:厚膜电阻;; LCSC Part Name: 100Ω ±1% 125mW 厚膜电阻; Supplier Part: C17408; Manufacturer: UNI-ROYAL(厚声); Supplier Footprint: 0805; JLCPCB Part Class: Basic Part; Datasheet: https://atta.szlcsc.com/upload/public/pdf/source/20200306/C422600_1E6D84923E4A46A82E41ADD87F860B5C.pdf; Supplier: LCSC; Tolerance: ±1%; Power(Watts): 125mW; Overload Voltage (Max): 150V; Temperature Coefficient: ±100ppm/℃; Type: 厚膜电阻; Operating Temperature Range: -55℃~+155℃
R39 R40 R47 R48 = 0805W8F1502T5E: 阻值:15kΩ;精度:±1%;功率:125mW;温度系数:±100ppm/℃;电阻类型:厚膜电阻;; LCSC Part Name: 15kΩ ±1% 125mW 厚膜电阻; Supplier Part: C17475; Manufacturer: UNI-ROYAL(厚声); Supplier Footprint: 0805; JLCPCB Part Class: Basic Part; Datasheet: https://atta.szlcsc.com/upload/public/pdf/source/20200306/C422600_1E6D84923E4A46A82E41ADD87F860B5C.pdf; Supplier: LCSC; Tolerance: ±1%; Power(Watts): 125mW; Overload Voltage (Max): 150V; Temperature Coefficient: ±100ppm/℃; Type: 厚膜电阻; Operating Temperature Range: -55℃~+155℃
U12 U13 = GS8558-SR: 放大器数:双路;增益带宽积(GBP):13MHz;输入偏置电流(Ib):100pA;输入失调电压(Vos):5uV;压摆率(SR):8V/us;; Supplier Part: C2978613; Manufacturer: Gainsil(聚洵); Supplier Footprint: SOIC-8; JLCPCB Part Class: 扩展库; Datasheet: https://atta.szlcsc.com/upload/public/pdf/source/20220301/8E925AB8A777EC1CC32D65DB4BC8C388.pdf; Supplier: LCSC; Number of Circuits: 双路; Gain Bandwidth Product(GBP): 13MHz; Current - Input Bias(Ib): 100pA; Voltage - Input Offset(Vos): 5uV; Common Mode Rejection Ratio (CMRR): 100dB; Slew Rate(SR): 8V/us; Supply Voltage: 2.5V~5.5V; Output Current: 109mA; Input Offset Voltage Drift (Vos TC): 0.027uV/°C; Supply Current: 1.3mA; Operating Temperature: -40℃~+125℃
BUZZER = HYT-0905_C7544823: 频率:2.9kHz;声压(SPL):85dB@5V,10cm;; LCSC Part Name: 有源蜂鸣器; Supplier Part: C7544823; Manufacturer: HYDZ(华宇); Manufacturer Part: HYT-0905; Supplier Footprint: DIP; JLCPCB Part Class: 扩展库; Datasheet: https://atta.szlcsc.com/upload/public/pdf/source/20230825/5BA4026039A750A308BFD2BED79844AF.pdf; Supplier: LCSC; Current Consumption: 30mA; Sound Pressure Level (SPL): 85dB@5V,10cm
C44 C47 = 0805CG200J500NT: 容值:20pF;精度:±5%;额定电压:50V;材质(温度系数):C0G;; LCSC Part Name: 20pF ±5% 50V; Supplier Part: C94472; Manufacturer: FH(风华); Supplier Footprint: 0805; JLCPCB Part Class: Extended Part; Datasheet: https://atta.szlcsc.com/upload/public/pdf/source/20170923/C94472_1506149578159988997.pdf; Supplier: LCSC; Tolerance: ±5%; Voltage Rated: 50V; Temperature Coefficient: C0G
C48 C50 = 0805CG120J500NT: 容值:12pF;精度:±5%;额定电压:50V;材质(温度系数):C0G;; LCSC Part Name: 12pF ±5% 50V; Supplier Part: C1792; Manufacturer: FH(风华); Supplier Footprint: 0805; JLCPCB Part Class: Basic Part; Datasheet: https://atta.szlcsc.com/upload/public/pdf/source/20170923/C1792_1506149354360988551.pdf; Supplier: LCSC; Tolerance: ±5%; Voltage Rated: 50V; Temperature Coefficient: C0G
C49 = CL21B104KBCNNNC: 容值:100nF;精度:±10%;额定电压:50V;材质(温度系数):X7R;; LCSC Part Name: 100nF ±10% 50V; Supplier Part: C1711; Manufacturer: SAMSUNG(三星); Supplier Footprint: 0805; JLCPCB Part Class: Extended Part; Datasheet: https://atta.szlcsc.com/upload/public/pdf/source/20160103/1457707693305.pdf; Supplier: LCSC; Tolerance: ±10%; Voltage Rated: 50V; Temperature Coefficient: X7R
H1 = HDR-M_2.54_1x4P: Supplier Part: C492403; Supplier Footprint: 插件
H2 H4 = BX-PH2.0-7PZZ: 插针结构:1x7P;间距:2mm;安装方式:直插;参考系列:PH;总PIN数:7P;排数:1;每排PIN数:7;行距:-;额定电流:2A;触头材质:黄铜;触头镀层:锡;工作温度范围:-25℃~+85℃;; Supplier Part: C18077749; Manufacturer: Bossie(博锡); Supplier Footprint: 插件,P=2mm; JLCPCB Part Class: 扩展库; Datasheet: https://atta.szlcsc.com/upload/public/pdf/source/20231017/AFA858640E38828F799B06911EC337E6.pdf; Supplier: LCSC; Pins Structure: 1x7P; Pitch: 2mm; Mounting Style: 直插; Reference Series: PH; Number of Pins: 7P; Number of Rows: 1; Number of PINs Per Row: 7; Current Rating (Max): 2A; Contact Material: 黄铜; Contact Plating: 锡; Operating Temperature Range: -25℃~+85℃
H3 = HDR-M_2.54_1x7P: Supplier Part: C492406; Supplier Footprint: 插件
H5 = HDR-M_2.54_1x2P: Supplier Part: C124375; Supplier Footprint: 插件
SW1 = TSA363G25-250B: 触点电流:50mA;额定电压(DC):12V;电路结构:单刀单掷;按钮作用方向:顶部触动;致动器样式:矩形按钮;照明颜色:-;开关长度:6.05mm;开关宽度:3.6mm;开关高度:2.5mm;; LCSC Part Name: 3*6*2.5  白柄贴片  250gf; Supplier Part: C354943; Manufacturer: BRIGHT(博瑞泰); Supplier Footprint: SMD; JLCPCB Part Class: Extended Part; Datasheet: https://atta.szlcsc.com/upload/public/pdf/source/20190426/C354943_F8D02988919B0D3B4D493E3C3D798834.pdf; Supplier: LCSC; Contact Current: 50mA; Voltage Rating (DC): 12V; Circuit: 单刀单掷; Actuator Orientation: 顶部触动; Actuator Style: 矩形按钮; Switch Length: 6.05mm; Switch Width: 3.6mm; Switch Height: 2.5mm
U9 = STM32G474RET6: CPU内核:ARM Cortex-M4;CPU最大主频:170MHz;工作电压范围:1.71V~3.6V;程序存储容量:512KB;RAM总容量:128KB;EEPROM/数据 FLASH容量:512KB;GPIO端口数量:52;ADC(位数):12bit;DAC(位数):12bit;(E)PWM(位数):-;外设/功能:PWM；看门狗；PWM;内部振荡器:有;工作温度范围:-40℃~+85℃;; LCSC Part Name: ARM Cortex-M4 170MHz; Supplier Part: C521608; Manufacturer: ST(意法半导体); Supplier Footprint: LQFP-64(10x10); JLCPCB Part Class: 扩展库; Datasheet: https://atta.szlcsc.com/upload/public/pdf/source/20200902/C431632_38212262685EE30B1989689374F08940.pdf; Supplier: LCSC; CPU Core: ARM Cortex-M4; CPU Maximum Speed: 170MHz; Operating Voltage Range: 1.71V~3.6V; Program Storage Size: 512KB; Program Memory Type: FLASH; RAM Size: 128KB; EEPROM: 512KB; GPIO Ports Number: 52; ADC (Bit): 12bit; DAC (Bit): 12bit; Peripheral/Function: PWM；看门狗；PWM; Internal Oscillator: 有; Operating Temperature Range: -40℃~+85℃
U10 = W25Q64JVSSIQ_C83140: 64M-bit/8M-byte FLASH芯片,SPI接口 133MHz(266/532MHz Dual/Quad-SPI) 比W25Q64FVSSIG更高速度; Supplier Part: C83140; Manufacturer: WINBOND(华邦); Supplier Footprint: SOP-8-208mil; JLCPCB Part Class: Extended Part; Datasheet: https://atta.szlcsc.com/upload/public/pdf/source/20161110/1478742546019.pdf; Supplier: LCSC
U11 = CH340C: 应用功能:Transceiver;接口协议:USB 2.0;数据速率:2Mbps;供电电压:3.3V；5V;; Supplier Part: C84681; Manufacturer: WCH(南京沁恒); Supplier Footprint: SOP-16; JLCPCB Part Class: Extended Part; Datasheet: https://atta.szlcsc.com/upload/public/pdf/source/20200819/C84681_ADBED554CE321879DBD6B1D06488689C.pdf; Supplier: LCSC; Applications Function: Transceiver; Protocol: USB 2.0; Data Rate: 2Mbps; Supply Voltage: 3.3V；5V
X1 = X503225MSB2GI: 频率:25MHz;频率公差:±10ppm;负载电容:20pF;; LCSC Part Name: 25MHz ±10ppm 20pF YSX530GA; Supplier Part: C112569; Manufacturer: YXC(扬兴晶振); Supplier Footprint: SMD5032-2P; JLCPCB Part Class: 扩展库; Datasheet: https://atta.szlcsc.com/upload/public/pdf/source/20210329/C112559_847D3CACBA33ACCEB57DEA3AEBB187A1.pdf; Supplier: LCSC; Crystal Type: 贴片无源晶振; Frequency Tolerance: ±10ppm; Frequency Stability: ±50ppm; Load Capacitance: 20pF; Operating Temperature: -40℃~+85℃
X2 = FC-135 32.7680KA-AG: 频率:32.768kHz;频率公差:±20ppm;负载电容:7pF;; LCSC Part Name: 32.768kHz ±20ppm 7pF; Supplier Part: C1669859; Manufacturer: EPSON(爱普生); Supplier Footprint: SMD3215-2P; JLCPCB Part Class: 扩展库; Datasheet: https://atta.szlcsc.com/upload/public/pdf/source/20211127/C2650476_CC369359C13F4A6248FBD5522D0F5ADF.pdf; Supplier: LCSC; Crystal Type: 贴片无源晶振; Frequency Tolerance: ±20ppm; Load Capacitance: 7pF; Equivalent Series Resistance (ESR): 70kΩ; Operating Temperature: -40℃~+85℃
C18 C25 = SPT1CM331E09OR: 容值:330uF;精度:±20%;额定电压:16V;纹波电流:-;等效串联电阻:-;类型:-;; LCSC Part Name: 330uF ±20% 16V; Supplier Part: C556219; Manufacturer: Yunxing(云星); Supplier Footprint: 插件,D6.3xL9mm; JLCPCB Part Class: 扩展库; Datasheet: https://atta.szlcsc.com/upload/public/pdf/source/20200519/C556210_20849F4C71C30C295F8AE8152F629B71.pdf; Supplier: LCSC; Tolerance: ±20%; Rated Voltage: 16V; Lead Spacing: 2.5mm; φD: 6.3mm; L: 9mm; Lifetime @ Temp: 2000hrs@105℃; Operating Temperature: -55℃~+105℃; 备注: 固态电容
C20 = CC0805KRX7R9BB104: 容值:100nF;精度:±10%;额定电压:50V;材质(温度系数):X7R;; LCSC Part Name: 100nF ±10% 50V; Supplier Part: C49678; Manufacturer: YAGEO(国巨); Supplier Footprint: 0805; JLCPCB Part Class: Basic Part; Datasheet: https://atta.szlcsc.com/upload/public/pdf/source/20151026/1457707504898.pdf; Supplier: LCSC; Tolerance: ±10%; Voltage Rated: 50V; Temperature Coefficient: X7R
C22 C29 C31 = CL21B105KBFNNNE: 容值:1uF;精度:±10%;额定电压:50V;材质(温度系数):X7R;; LCSC Part Name: 1uF ±10% 50V; Supplier Part: C28323; Manufacturer: SAMSUNG(三星); Supplier Footprint: 0805; JLCPCB Part Class: Basic Part; Datasheet: https://atta.szlcsc.com/upload/public/pdf/source/20160103/1457707718219.pdf; Supplier: LCSC; Tolerance: ±10%; Voltage Rated: 50V; Temperature Coefficient: X7R
C23 = CL21C101JBANNNC: 容值:100pF;精度:±5%;额定电压:50V;材质(温度系数):C0G;; LCSC Part Name: 100pF ±5% 50V; Supplier Part: C1790; Manufacturer: SAMSUNG(三星); Supplier Footprint: 0805; JLCPCB Part Class: Basic Part; Datasheet: https://atta.szlcsc.com/upload/public/pdf/source/20160103/1457707696871.pdf; Supplier: LCSC; Tolerance: ±5%; Voltage Rated: 50V; Temperature Coefficient: C0G
L3 L4 = SWPA4030S100MT: 电感值:10uH;精度:±20%;额定电流:1.5A;饱和电流(Isat):2.4A;类型:-;; LCSC Part Name: 10uH ±20% 2.4A; Supplier Part: C38117; Manufacturer: Sunlord(顺络); Supplier Footprint: SMD; JLCPCB Part Class: 扩展库; Datasheet: https://atta.szlcsc.com/upload/public/pdf/source/20231024/317626D2AA2F8AB4113C1875E432E6E1.pdf; Supplier: LCSC; Tolerance: ±20%; Rated Current: 1.5A; Saturation Current (Isat): 2.4A; DC Resistance (DCR): 130mΩ
LED2 = NCD0805R1: 灯头类型:-;发光颜色:红色;正向电压(VF):1.6V~2.6V;功率:65mW;正向电流:20mA;主波长:615nm~630nm;二极管配置:独立二极管;透镜颜色:无色透明;色温:-;发光强度:67mcd~195mcd;发光角度:130°;载带方式:-;工作温度:-30℃~+85℃;; Supplier Part: C84256; Manufacturer: 国星光电; Supplier Footprint: 0805; JLCPCB Part Class: Basic Part; Datasheet: https://atta.szlcsc.com/upload/public/pdf/source/20200820/C84256_F0A75A43B3EAD75808600A0514C76B99.pdf; Supplier: LCSC; Emitted Color: 红色; Forward Voltage (VF): 1.6V~2.6V; Power Dissipation: 65mW; Forward Current: 20mA; Dominant Wavelength: 615nm~630nm; Diode Configuration: 独立二极管; Lens Color: 无色透明; Luminous Intensity: 67mcd~195mcd; Viewing Angle: 130°; Operating Temperature: -30℃~+85℃
LED3 = LED_0805-G: Supplier Footprint: 0805
R26 = 0805W8F1001T5E: 电阻类型:厚膜电阻;阻值:1kΩ;精度:±1%;功率:125mW;; LCSC Part Name: 1kΩ ±1% 125mW; Supplier Part: C17513; Manufacturer: UNI-ROYAL(厚声); Supplier Footprint: 0805; JLCPCB Part Class: Basic Part; Datasheet: https://atta.szlcsc.com/upload/public/pdf/source/20200306/C422600_1E6D84923E4A46A82E41ADD87F860B5C.pdf; Supplier: LCSC; Tolerance: ±1%; Power(Watts): 125mW; Overload Voltage (Max): 150V; Temperature Coefficient: ±100ppm/℃; Type: 厚膜电阻; Operating Temperature Range: -55℃~+155℃
R27 = 0805W8F3001T5E: 阻值:3kΩ;精度:±1%;功率:125mW;温度系数:±100ppm/℃;电阻类型:厚膜电阻;; LCSC Part Name: 3kΩ ±1% 125mW 厚膜电阻; Supplier Part: C17661; Manufacturer: UNI-ROYAL(厚声); Supplier Footprint: 0805; JLCPCB Part Class: Basic Part; Datasheet: https://atta.szlcsc.com/upload/public/pdf/source/20200306/C422600_1E6D84923E4A46A82E41ADD87F860B5C.pdf; Supplier: LCSC; Tolerance: ±1%; Power(Watts): 125mW; Overload Voltage (Max): 150V; Temperature Coefficient: ±100ppm/℃; Type: 厚膜电阻; Operating Temperature Range: -55℃~+155℃
U4 = TPS54360BDDAR: 功能类型:降压型;同步整流:否;输出类型:可调;输出通道数:1;拓扑结构:降压式;输入电压:4.5V~60V;输出电压:800mV~58.8V;输出电流(最大值):3.5A;开关频率:2.5MHz;工作温度:-40℃~+150℃@(TJ);; LCSC Part Name: 降压型 Vin=4.5V~60V Vout=800mV~58.8V 3.5A; Supplier Part: C524806; Manufacturer: TI(德州仪器); Supplier Footprint: SO-8; JLCPCB Part Class: 扩展库; Datasheet: https://atta.szlcsc.com/upload/public/pdf/source/20200429/C524806_8ED66DF2633F11513785BFA966CBCF4A.pdf; Supplier: LCSC; Function: 降压型; Synchronous Rectification: 否; Output Type: 可调; Number of Outputs: 1; Topology: 降压式; Input Voltage: 4.5V~60V; Output Voltage: 800mV~58.8V; Output Current (Max): 3.5A; Switching Frequency: 2.5MHz; Operating Temperature: -40℃~+150℃@(TJ)
U5 = SY8205FCC: 功能类型:降压型;同步整流:-;输出通道数:-;拓扑结构:-;输入电压:-;输出电流(最大值):-;开关频率:-;; LCSC Part Name: 降压型; Supplier Part: C111875; Manufacturer: silergy(矽力杰); Supplier Footprint: SOIC-8-EP; JLCPCB Part Class: Extended Part; Datasheet: https://atta.szlcsc.com/upload/public/pdf/source/20180224/C111875_15194360670851363275.pdf; Supplier: LCSC; Function: 降压型
U6 = AMS1117-5.0_C5345984: 输出类型:固定;最大输入电压:18V;输出电压:5V;输出电流:1A;输出极性:正;; LCSC Part Name: 输入18V 输出5V 1A; Supplier Part: C5345984; Manufacturer: HXY MOSFET(华轩阳电子); Supplier Footprint: SOT-223; JLCPCB Part Class: 扩展库; Datasheet: https://atta.szlcsc.com/upload/public/pdf/source/20230112/E762ED9FBAA0859C5A1A23C5A68BE95D.pdf; Supplier: LCSC; Output Type: 固定; Maximum Input Voltage: 18V; Output Voltage: 5V; Output Current: 1A; Dropout Voltage: 1.4V@(1A); Output Polarity: 正; Number of Outputs: 1
U7 = AMS1117-3.3_C5250992: 输出类型：固定 输出极性：正 最大输入电压：18V 输出电压：3.3V 输出电流：1A 电源纹波抑制比(PSRR)：60dB@(120Hz)。当前应用较多领域：三端稳压器，机顶盒; Supplier Part: C5250992; Manufacturer: TWGMC(台湾迪嘉); Supplier Footprint: SOT-223-3L; JLCPCB Part Class: 扩展库; Datasheet: https://atta.szlcsc.com/upload/public/pdf/source/20221109/A58A92B07670E85D28928AE371260E8D.pdf; Supplier: LCSC
U8 = REF3033AIDBZR: REF3033 采用 SOT23-3 封装的 3.3V 输出 50ppm/℃ 漂移 50uA 静态电流的（带隙）电压参考系列; Supplier Part: C36658; Manufacturer: TI(德州仪器); Supplier Footprint: SOT-23; JLCPCB Part Class: 扩展库; Datasheet: https://atta.szlcsc.com/upload/public/pdf/source/20140924/1457707240664.pdf; Supplier: LCSC

## Nets
GND: C1.1 C2.1 C3.1 C4.2 C5.2 C6.1 C7.1 C8.2 C9.2 C10.1 C11.1 C12.1 C15.1 C16.1 C18.2 C19.1 C21.1 C22.1 C24.1 C25.2 C26.1 C27.1 C28.2 C29.1 C30.2 C31.1 C32.1 C33.1 C34.1 C35.1 C36.1 C37.1 C38.1 C39.1 C40.2 C41.2 C42.1 C43.1 C44.1 C45.1 C46.2 C47.1 C48.1 C49.1 C50.1 C51.2 C52.2 C53.1 C54.1 C55.1 C56.1 C57.2 C58.1 C59.1 D12.2(A) D13.2(A) H1.1 H2.2 H3.2 LED2.1(C) LED3.1(C) Q1.2(S) Q4.1(S) Q4.2(S) Q4.3(S) Q5.1(S) Q5.2(S) Q5.3(S) Q6.2(S) R4.1 R6.1 R9.1 R10.1 R11.1 R12.1 R13.2 R14.1 R24.1 R25.1 R26.1 R28.2 R29.2 R39.2 R40.2 R41.1 R46.1 R50.1 R52.1 SW1.1 TP5.1 U1.11(GND) U2.4(GND) U3.4(GND) U4.7(GND) U4.9(PAD) U5.9(EPAD) U6.1(GND) U7.1(GND) U8.3(GND) U9.15(VSS) U9.27(VSSA) U9.31(VSS) U9.47(VSS) U9.63(VSS) U10.4(GND) U11.1(GND) U12.4(VSS) U13.4(VSS)
P3V3: BUZZER.1(+) C34.2 C35.2 C45.2 C46.1 C51.1 C52.1 C53.2 C55.2 C56.2 C57.1 D13.1(K) H1.4 H2.1 H3.1 H5.2 R49.2 TP11-3.3V.1 U7.2(VOUT) U7.4(TAB) U9.1(VBAT) U9.16(VDD) U9.29(VDDA) U9.32(VDD) U9.48(VDD) U9.64(VDD) U10.3(IO2) U10.7(IO3) U10.8(VCC)
P5V: C33.2 C36.2 C40.1 C41.1 C58.2 D14.1(K) H2.3 H3.3 R27.1 TP10-5V.1 U6.2(Vout) U6.4(Vout) U7.3(VIN) U8.1(IN) U11.16(VCC) U12.8(VDD) U13.8(VDD)
P6V: C23.2 C24.2 C25.1 C32.2 L4.2 R23.2 TP9-6V.1 U6.3(Vin)
P12V: C2.2 C15.2 C16.2 C18.1 C19.2 C21.2 C22.2 CN1.1 D2.1(K) D6.2(A) D7.2(A) L3.2 R19.2 R20.2 R22.1 TP8-12V.1 U2.1(VDD) U3.1(VDD) U5.7(VIN) U5.8(VIN)
VBUS: D1.1(A) D3.1(A) D4.1(A) R1.2 R3.2 USB1.A4(VBUS) USB1.A9(VBUS) USB1.B4(VBUS) USB1.B9(VBUS)
VBUS2: D14.2(A) USB2.A4(VBUS) USB2.A9(VBUS) USB2.B4(VBUS) USB2.B9(VBUS)
VIN+: C4.1 C5.1 C6.2 C7.2 C26.2 C27.2 D5.2(K) FH1.2 Q2.5(D) Q2.6(D) Q2.7(D) Q2.8(D) Q2.9(D) R9.2 R30.1 U4.2(VIN)
VIN-: D5.1(A) DC1.2 DC1.3 R13.1 R32.1 R43.1 USB1.1(EP) USB1.2(EP) USB1.3(EP) USB1.4(EP) USB1.A1(GND) USB1.A12(GND) USB1.B1(GND) USB1.B12(GND) USB2.1(EP) USB2.2(EP) USB2.3(EP) USB2.4(EP) USB2.A1(GND) USB2.A12(GND) USB2.B1(GND) USB2.B12(GND)
ADC_Iin: C42.2 R44.1 U9.13(PA1)
ADC_Iout: C43.2 R45.1 U9.17(PA3)
ADC_TEMP: C3.2 R2.1 R4.2 U9.18(PA4)
ADC_Vin: C38.2 R33.1 U9.12(PA0)
ADC_Vout: C39.2 R35.1 U9.14(PA2)
BOOT0: H5.1 R50.2 U9.61(PB8-BOOT0)
CC1: U1.7(CC1) USB1.A5(CC1)
CC2: U1.6(CC2) USB1.B5(CC2)
CH340_RXD: U9.43(PA9) U11.3(RXD)
CH340_TXD: U9.44(PA10) U11.2(TXD)
D+: U11.5(D+) USB2.A6(DP1) USB2.B6(DP2)
D-: U11.6(D-) USB2.A7(DN1) USB2.B7(DN2)
DN: U1.5(DM) USB1.A7(DN1) USB1.B7(DN2)
DP: U1.4(DP) USB1.A6(DP1) USB1.B6(DP2)
EN: R22.2 U5.3(EN)
FAN_PWM: R5.2 U9.40(PC8)
Gate1-H: D8.2(A) Q2.4(G) R7.2 R15.1 TP3-G1H.1
Gate1-L: D10.2(A) Q4.4(G) R11.2 R17.1 TP6-G1L.1
Gate2-H: D9.2(A) Q3.4(G) R8.2 R16.1 TP4-G2H.1
Gate2-L: D11.2(A) Q5.4(G) R12.2 R18.1 TP7-G2L.1
HRTIM1_CHD1: U2.3(LIN) U9.36(PB14)
HRTIM1_CHD2: U2.2(HIN) U9.37(PB15)
HRTIM1_CHF1: U3.3(LIN) U9.38(PC6)
HRTIM1_CHF2: U3.2(HIN) U9.39(PC7)
HS-1: C13.1 L1.1 L2.1 Q2.1(S) Q2.2(S) Q2.3(S) Q4.5(D) Q4.6(D) Q4.7(D) Q4.8(D) Q4.9(D) R7.1 TP1-HS1.1 U2.6(VS)
HS-2: C14.1 L1.2 L2.2 Q3.1(S) Q3.2(S) Q3.3(S) Q5.5(D) Q5.6(D) Q5.7(D) Q5.8(D) Q5.9(D) R8.1 TP2-HS2.1 U3.6(VS)
I2C1_SCL: U9.51(PA15)
I2C1_SDA: U9.60(PB7)
I2C3_SCL: H2.6 H3.6 U9.42(PA8)
I2C3_SDA: H2.7 H3.7 U9.41(PC9)
PA5: U9.19(PA5)
PA6: H4.4 U9.20(PA6)
PA7: H4.5 U9.21(PA7)
PA11: U9.45(PA11)
PA12: U9.46(PA12)
PB0/AD15: U9.24(PB0)
PB1/AD12: U9.25(PB1)
PB2: U9.26(PB2)
PB3: H2.4 H3.4 U9.56(PB3)
PB4: H2.5 H3.5 U9.57(PB4)
PB5: R51.2 U9.58(PB5)
PB6: U9.59(PB6)
PB9: U9.62(PB9)
PB10: U9.30(PB10)
PB11: U9.33(PB11)
PB12: U9.34(PB12)
PB13: U9.35(PB13)
PC0: H4.1 U9.8(PC0)
PC1: H4.2 U9.9(PC1)
PC2: H4.3 U9.10(PC2)
PC3/AD9: U9.11(PC3)
PC4: H4.6 U9.22(PC4)
PC5: H4.7 U9.23(PC5)
PC10: U9.52(PC10) U10.6(CLK)
PC11: U9.53(PC11) U10.2(DO)
PC12: U9.54(PC12) U10.5(DI)
PC13: U9.2(PC13)
PD2: U9.55(PD2) U10.1(CS#)
REF_3V3: C37.2 C54.2 R2.2 TP12-REF.1 U8.2(OUT) U9.28(VREF+)
RST: C49.2 R49.1 SW1.2 U9.7(PG10-NRST)
SWCLK: H1.2 U9.50(PA14)
SWDIO: H1.3 U9.49(PA13)
VOUT+: C8.1 C9.1 C10.2 C11.2 C12.2 CNT1.1 CNT1.2 CNT1.3 CNT1.4 Q3.5(D) Q3.6(D) Q3.7(D) Q3.8(D) Q3.9(D) R10.2 R34.1 TP13.1
VOUT-: CNT2.1 CNT2.2 CNT2.3 CNT2.4 R14.2 R36.1 R42.1
XIN: C48.2 U9.3(PC14-OSC32_IN) X2.2(OSC2)
XOUT: C50.2 U9.4(PC15-OSC32_OUT) X2.1(OSC1)
XT2IN: C44.2 U9.5(PF0-OSC_IN) X1.2(OSC2)
XT2OUT: C47.2 U9.6(PF1-OSC_OUT) X1.1(OSC1)
$1N1620: C1.2 R1.1 U1.1(VDD)
$1N1981: R3.1 U1.8(VBUS)
$1N2183: D1.2(K) D3.2(K) D4.2(K) DC1.1 FH1.1
$1N5907: C13.2 D6.1(K) U2.8(VB)
$1N5910: D8.1(K) R15.2 U2.7(HO)
$1N5913: D10.1(K) R17.2 U2.5(LO)
$1N5920: C14.2 D7.1(K) U3.8(VB)
$1N5923: D9.1(K) R16.2 U3.7(HO)
$1N5926: D11.1(K) R18.2 U3.5(LO)
$1N7961: Q1.1(G) R5.1 R6.2
$1N8016: CN1.2 D2.2(A) Q1.3(D)
$2N1500: R24.2 U4.4(RT/CLK)
$2N1503: C17.2 D12.1(K) L3.1 U4.8(SW)
$2N1504: C17.1 U4.1(BOOT)
$2N1505: C30.1 R21.1
$2N1506: C28.1 R21.2 U4.6(COMP)
$2N1507: R19.1 R25.2 U4.5(FB)
$2N1508: LED3.2(A) R20.1
$2N2108: C29.2 U5.6(VCC)
$2N2110: C20.2 L4.1 U5.2(LX)
$2N2115: C23.1 R23.1 R26.2 U5.5(FB)
$2N2117: C31.2 U5.4(SS)
$2N2130: C20.1 U5.1(BS)
$2N3829: LED2.2(A) R27.2
$3N1892: R28.1 R30.2 U12.3(+INA)
$3N1896: R32.2 R37.2 U12.2(-INA)
$3N1897: R33.2 R37.1 U12.1(OUTA)
$3N1903: R39.1 R41.2 U12.5(+INB)
$3N1906: R43.2 R47.2 U12.6(-INB)
$3N1907: R44.2 R47.1 U12.7(OUTB)
$3N1910: R29.1 R31.2 U13.3(+INA)
$3N1914: R36.2 R38.2 U13.2(-INA)
$3N1915: R35.2 R38.1 U13.1(OUTA)
$3N1921: R40.1 R42.2 U13.5(+INB)
$3N1923: R46.2 R48.2 U13.6(-INB)
$3N1924: R45.2 R48.1 U13.7(OUTB)
$3N2124: R31.1 R34.2 TP14.1
$4N3840: BUZZER.2(-) Q6.3(D)
$4N3848: Q6.1(G) R51.1 R52.2
$4N4666: C59.2 U11.4(V3)

Not connected (* = marked no-connect by the designer): TP15 1; TP16 1; TP17 1; TP18 1; U1 2(CFG2)* 3(CFG3)* 9(CFG1)* 10(PG)*; U4 3(EB)*; U11 7(NC.)* 8(OUT#)* 9(CTS#)* 10(DSR#)* 11(RI#)* 12(DCD#)* 13(DTR#)* 14(RTS#)* 15(R232)*; USB1 A8(SBUS1)* B8(SBUS2)*; USB2 A5(CC1)* A8(SBUS1)* B5(CC2)* B8(SBUS2)*

## Notes on the sheets
sheet 1
- 温度采样
  NTC分压电路
- 电源输入接口
- PD快充诱骗电路
- 散热风扇驱动
- 两种封装的电感选一种焊接即可
- MOS管驱动电路
sheet 2
- 开关频率：876.5kHz
- 6V辅助电源（DCDC）
- 12V辅助电源（DCDC）
- 3.3V电压基准
- 5V和3.3V辅助电源（LDO）
sheet 3
- 电压采样放大倍数=4.7/75=0.062667
  最大量程：52.7V
- 输入电压采样
- 输出电压采样
- 电流采样放大倍数=6200/100=62
  最大量程：10.6A
- 输入电流采样
- 输出电流采样
sheet 4
- 烧录接口
- Flash
- USB转串口
- 蜂鸣器驱动
